# EAGLE design FlightComputer_RevA (EAGLE 9.0.1)
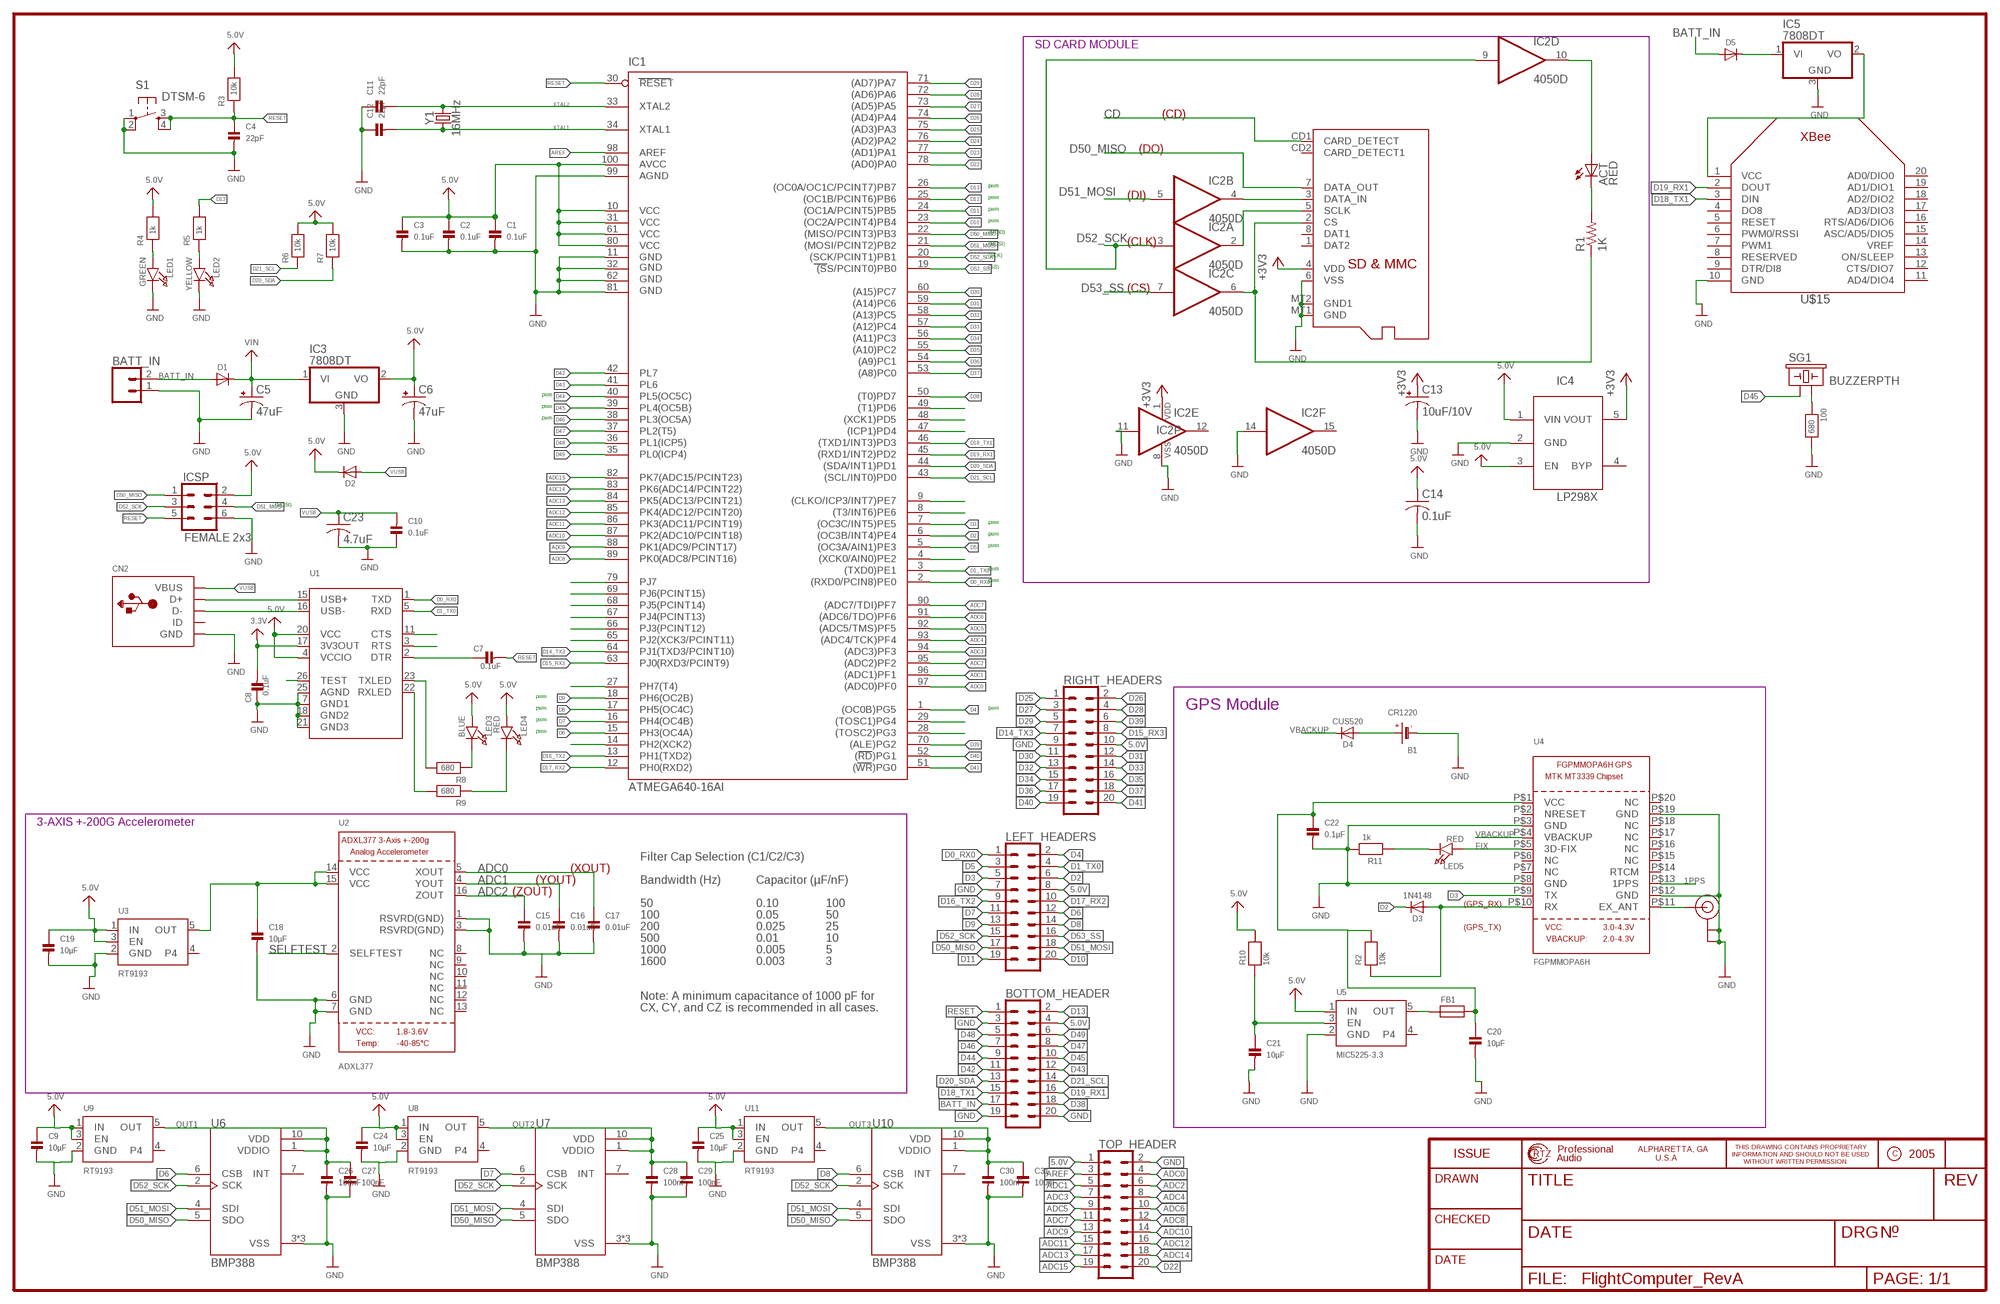
[diagram p0: schematic, sheet 1]

## Parts
100  680  RESISTOR0603  [0603]
ACT  RED  LEDCHIP-LED0805  [CHIP-LED0805]
B1  CR1220  BATTERYCR1220_SMT  [CR1220]
BATT_IN  CONN_02  [1X02]
BOTTOM_HEADER  CONN_10X2  [2X10]
C1  0.1uF  CAP_CERAMIC0603  [0603]
C2  0.1uF  CAP_CERAMIC0603  [0603]
C3  0.1uF  CAP_CERAMIC0603  [0603]
C4  22pF  CAP_CERAMIC0603  [0603]
C5  47uF  CPOL-USD  [PANASONIC_D]
C6  47uF  CPOL-USD  [PANASONIC_D]
C7  0.1uF  CAP_CERAMIC0603  [0603]
C8  0.1uF  CAP_CERAMIC0603  [0603]
C9  10µF  CAP_CERAMIC0603  [0603]
C10  0.1uF  CAP_CERAMIC0603  [0603]
C11  22pF  CAP_CERAMIC0603  [0603]
C12  22pF  CAP_CERAMIC0603  [0603]
C13  10uF/10V  CPOL-USA/3216-18R  [A/3216-18R]
C14  0.1uF  C-USC0805K  [C0805K]
C15  0.01uF  CAP_CERAMIC0603  [0603]
C16  0.01uF  CAP_CERAMIC0603  [0603]
C17  0.01uF  CAP_CERAMIC0603  [0603]
C18  10µF  CAP_CERAMIC0603  [0603]
C19  10µF  CAP_CERAMIC0603  [0603]
C20  10µF  CAP_CERAMIC0603  [0603]
C21  10µF  CAP_CERAMIC0603  [0603]
C22  0.1µF  CAP_CERAMIC0603  [0603]
C23  4.7uF  C-USC0603  [C0603]
C24  10µF  CAP_CERAMIC0603  [0603]
C25  10µF  CAP_CERAMIC0603  [0603]
C26  100nF  CAP_CERAMIC0603  [0603]
C27  100nF  CAP_CERAMIC0603  [0603]
C28  100nF  CAP_CERAMIC0603  [0603]
C29  100nF  CAP_CERAMIC0603  [0603]
C30  100nF  CAP_CERAMIC0603  [0603]
C31  100nF  CAP_CERAMIC0603  [0603]
CN2  USBMINIB  [USB-MINIB]
D1  DIODESOD-123  [SOD-123]
D2  DIODESOD-123  [SOD-123]
D3  1N4148  DIODESOD-323  [SOD-323]
D4  CUS520  DIODESOD-323  [SOD-323]
D5  DIODESOD-123  [SOD-123]
FB1  FERRITE  [0603]
IC1  ATMEGA640-16AI  [TQFP100]
IC2  4050D  [SO16]
IC3  7808DT  [TO252]
IC4  LP298XS  [SOT23-5L]
IC5  7808DT  [TO252]
ICSP  FEMALE 2x3  CONN_03X2FEMALE  [2X3]
LED1  GREEN  LED0603  [CHIPLED_0603]
LED2  YELLOW  LED0603  [CHIPLED_0603]
LED3  BLUE  LED0603  [CHIPLED_0603]
LED4  RED  LED0603  [CHIPLED_0603]
LED5  RED  LED0805  [CHIPLED_0805]
LEFT_HEADERS  CONN_10X2  [2X10]
R1  1K  R-US_R0805  [R0805]
R2  10k  RESISTOR0603  [0603]
R3  10k  RESISTOR0603  [0603]
R4  1k  RESISTOR0603  [0603]
R5  1k  RESISTOR0603  [0603]
R6  10k  RESISTOR0603  [0603]
R7  10k  RESISTOR0603  [0603]
R8  680  RESISTOR0603  [0603]
R9  680  RESISTOR0603  [0603]
R10  10k  RESISTOR0603  [0603]
R11  1k  RESISTOR0603  [0603]
RIGHT_HEADERS  CONN_10X2  [2X10]
S1  DTSM-6  [DTSM-6]
SG1  BUZZERPTH  [BUZZER-12MM]
TOP_HEADER  CONN_10X2  [2X10]
U1  FT232RLSSOP28  [SSOP28DB]
U2  ADXL377  ACCEL_ADXL377  [LFCSP16_LQ]
U3  RT9193  VREG_SOT23-5  [SOT23-5]
U4  FGPMMOPA6H  GPS_FGPMMOPA6H  [FGPMMOPA6H]
U5  MIC5225-3.3  VREG_SOT23-5  [SOT23-5]
U6  BMP388  [PQFN50P200X200X80-10N]
U7  BMP388  [PQFN50P200X200X80-10N]
U8  RT9193  VREG_SOT23-5  [SOT23-5]
U9  RT9193  VREG_SOT23-5  [SOT23-5]
U10  BMP388  [PQFN50P200X200X80-10N]
U11  RT9193  VREG_SOT23-5  [SOT23-5]
U$15  XBEE  [XBEE]
U$55  U.FL  [U.FL]
X1  MICROSD  [MICROSD]
Y1  16MHz  CRYSTAL-16MHZPTH-HC49US  [HC49US]

## Nets
1PPS: U4.P$13(1PPS)
3.3V: C8.2 U1.17(3V3OUT)
5.0V: BOTTOM_HEADER.4 C1.1 C2.1 C3.1 C6.+ C9.1 C14.1 C19.1 C24.1 C25.1 D2.C IC1.10(VCC) IC1.31(VCC1) IC1.61(VCC2) IC1.80(VCC3) IC1.100(AVCC) IC3.2(VO) IC4.1(VIN) IC4.3(EN) ICSP.2 LED3.A LED4.A LEFT_HEADERS.8 R3.2 R4.2 R6.2 R7.2 R10.2 RIGHT_HEADERS.10 TOP_HEADER.1 U1.4(VCCIO) U1.20(VCC) U3.1(IN) U3.3(EN) U5.1(IN) U8.1(IN) U8.3(EN) U9.1(IN) U9.3(EN) U11.1(IN) U11.3(EN)
+3V3: C13.+ IC2.1(P:VDD) IC4.5(VOUT) X1.4(VDD)
ADC0: C17.1 IC1.97((ADC0)PF0) TOP_HEADER.4 U2.5(XOUT)
ADC1: C16.1 IC1.96((ADC1)PF1) TOP_HEADER.5 U2.4(YOUT)
ADC2: C15.1 IC1.95((ADC2)PF2) TOP_HEADER.6 U2.16(ZOUT)
ADC3: IC1.94((ADC3)PF3) TOP_HEADER.7
ADC4: IC1.93((ADC4/TCK)PF4) TOP_HEADER.8
ADC5: IC1.92((ADC5/TMS)PF5) TOP_HEADER.9
ADC6: IC1.91((ADC6/TDO)PF6) TOP_HEADER.10
ADC7: IC1.90((ADC7/TDI)PF7) TOP_HEADER.11
ADC8: IC1.89(PK0(ADC8/PCINT16)) TOP_HEADER.12
ADC9: IC1.88(PK1(ADC9/PCINT17)) TOP_HEADER.13
ADC10: IC1.87(PK2(ADC10/PCINT18)) TOP_HEADER.14
ADC11: IC1.86(PK3(ADC11/PCINT19)) TOP_HEADER.15
ADC12: IC1.85(PK4(ADC12/PCINT20)) TOP_HEADER.16
ADC13: IC1.84(PK5(ADC13/PCINT21)) TOP_HEADER.17
ADC14: IC1.83(PK6(ADC14/PCINT22)) TOP_HEADER.18
ADC15: IC1.82(PK7(ADC15/PCINT23)) TOP_HEADER.19
AREF: IC1.98(AREF) TOP_HEADER.3
BATT_IN: BATT_IN.2 BOTTOM_HEADER.17 D1.A D5.A
CD: X1.CD1(CARD_DETECT)
D0_RX0: IC1.2((RXD0/PCIN8)PE0) LEFT_HEADERS.1 U1.1(TXD)
D1_TX0: IC1.3((TXD0)PE1) LEFT_HEADERS.4 U1.5(RXD)
D2: D3.C IC1.6((OC3B/INT4)PE4) LEFT_HEADERS.6
D3: IC1.7((OC3C/INT5)PE5) LEFT_HEADERS.5 U4.P$9(TX)
D4: IC1.1((OC0B)PG5) LEFT_HEADERS.2
D5: IC1.5((OC3A/AIN1)PE3) LEFT_HEADERS.3
D6: IC1.15(PH3(OC4A)) LEFT_HEADERS.12 U6.6(CSB)
D7: IC1.16(PH4(OC4B)) LEFT_HEADERS.11 U7.6(CSB)
D8: IC1.17(PH5(OC4C)) LEFT_HEADERS.14 U10.6(CSB)
D9: IC1.18(PH6(OC2B)) LEFT_HEADERS.13
D10: IC1.23((OC2A/PCINT4)PB4) LEFT_HEADERS.20
D11: IC1.24((OC1A/PCINT5)PB5) LEFT_HEADERS.19
D12: IC1.25((OC1B/PCINT6)PB6)
D13: BOTTOM_HEADER.2 IC1.26((OC0A/OC1C/PCINT7)PB7) R5.2
D14_TX3: IC1.64(PJ1(TXD3/PCINT10)) RIGHT_HEADERS.7
D15_RX3: IC1.63(PJ0(RXD3/PCINT9)) RIGHT_HEADERS.8
D16_TX2: IC1.13(PH1(TXD2)) LEFT_HEADERS.9
D17_RX2: IC1.12(PH0(RXD2)) LEFT_HEADERS.10
D18_TX1: BOTTOM_HEADER.15 IC1.46((TXD1/INT3)PD3) U$15.3(DIN)
D19_RX1: BOTTOM_HEADER.16 IC1.45((RXD1/INT2)PD2) U$15.2(DOUT)
D20_SDA: BOTTOM_HEADER.13 IC1.44((SDA/INT1)PD1) R7.1
D21_SCL: BOTTOM_HEADER.14 IC1.43((SCL/INT0)PD0) R6.1
D22: IC1.78((AD0)PA0) TOP_HEADER.20
D23: IC1.77((AD1)PA1)
D24: IC1.76((AD2)PA2)
D25: IC1.75((AD3)PA3) RIGHT_HEADERS.1
D26: IC1.74((AD4)PA4) RIGHT_HEADERS.2
D27: IC1.73((AD5)PA5) RIGHT_HEADERS.3
D28: IC1.72((AD6)PA6) RIGHT_HEADERS.4
D29: IC1.71((AD7)PA7) RIGHT_HEADERS.5
D30: IC1.60((A15)PC7) RIGHT_HEADERS.11
D31: IC1.59((A14)PC6) RIGHT_HEADERS.12
D32: IC1.58((A13)PC5) RIGHT_HEADERS.13
D33: IC1.57((A12)PC4) RIGHT_HEADERS.14
D34: IC1.56((A11)PC3) RIGHT_HEADERS.15
D35: IC1.55((A10)PC2) RIGHT_HEADERS.16
D36: IC1.54((A9)PC1) RIGHT_HEADERS.17
D37: IC1.53((A8)PC0) RIGHT_HEADERS.18
D38: BOTTOM_HEADER.18 IC1.50((T0)PD7)
D39: IC1.70((ALE)PG2) RIGHT_HEADERS.6
D40: IC1.52((RD)PG1) RIGHT_HEADERS.19
D41: IC1.51((WR)PG0) RIGHT_HEADERS.20
D42: BOTTOM_HEADER.11 IC1.42(PL7)
D43: BOTTOM_HEADER.12 IC1.41(PL6)
D44: BOTTOM_HEADER.9 IC1.40(PL5(OC5C))
D45: BOTTOM_HEADER.10 IC1.39(PL4(OC5B)) SG1.+
D46: BOTTOM_HEADER.7 IC1.38(PL3(OC5A))
D47: BOTTOM_HEADER.8 IC1.37(PL2(T5))
D48: BOTTOM_HEADER.5 IC1.36(PL1(ICP5))
D49: BOTTOM_HEADER.6 IC1.35(PL0(ICP4))
D50_MISO: IC1.22((MISO/PCINT3)PB3) ICSP.1 LEFT_HEADERS.17 U6.5(SDO) U7.5(SDO) U10.5(SDO) X1.7(DATA_OUT)
D51_MOSI: IC1.21((MOSI/PCINT2)PB2) IC2.5(B:I) ICSP.4 LEFT_HEADERS.18 U6.4(SDI) U7.4(SDI) U10.4(SDI)
D52_SCK: IC1.20((SCK/PCINT1)PB1) IC2.3(A:I) IC2.9(D:I) ICSP.3 LEFT_HEADERS.15 U6.2(SCK) U7.2(SCK) U10.2(SCK)
D53_SS: IC1.19((SS/PCINT0)PB0) IC2.7(C:I) LEFT_HEADERS.16
FIX: LED5.A U4.P$5(3D-FIX)
GND: 100.2 B1.- BATT_IN.1 BOTTOM_HEADER.3 BOTTOM_HEADER.19 BOTTOM_HEADER.20 C1.2 C2.2 C3.2 C4.2 C5.- C6.- C8.1 C9.2 C10.1 C11.1 C12.1 C13.- C14.2 C15.2 C16.2 C17.2 C18.2 C19.2 C20.2 C21.2 C22.2 C23.2 C24.2 C25.2 C26.2 C27.2 C28.2 C29.2 C30.2 C31.2 CN2.GND IC1.11(GND) IC1.32(GND1) IC1.62(GND2) IC1.81(GND3) IC1.99(AGND) IC2.8(P:VSS) IC2.11(E:I) IC2.14(F:I) IC3.3(GND) IC4.2(GND) IC5.3(GND) ICSP.6 LED1.C LED2.C LEFT_HEADERS.7 R11.2 RIGHT_HEADERS.9 S1.1 S1.2 TOP_HEADER.2 U1.7(GND1) U1.18(GND2) U1.21(GND3) U1.25(AGND) U2.1(RSVRD(GND)) U2.3(RSVRD(GND)) U2.6(GND) U2.7(GND) U3.2(GND) U4.P$3(GND) U4.P$8(GND) U4.P$12(GND) U4.P$19(GND) U5.2(GND) U6.3(VSS) U6.8(VSS) U6.9(VSS) U7.3(VSS) U7.8(VSS) U7.9(VSS) U8.2(GND) U9.2(GND) U10.3(VSS) U10.8(VSS) U10.9(VSS) U11.2(GND) U$15.10(GND) U$55.P$1(GND) U$55.P$2(GND) X1.6(VSS) X1.MT1(GND) X1.MT2(GND1)
N$1: IC1.65(PJ2(XCK3/PCINT11))
N$2: IC1.66(PJ3(PCINT12))
N$3: ACT.A IC2.10(D:O)
N$4: IC1.67(PJ4(PCINT13))
N$5: IC1.68(PJ5(PCINT14))
N$6: IC1.69(PJ6(PCINT15))
N$7: IC1.79(PJ7)
N$8: IC1.27(PH7(T4))
N$9: IC1.9((CLKO/ICP3/INT7)PE7)
N$10: IC1.49((T1)PD6)
N$11: IC1.48((XCK1)PD5)
N$12: IC1.47((ICP1)PD4)
N$13: IC1.14(PH2(XCK2))
N$14: IC1.8((T3/INT6)PE6)
N$15: D5.C IC5.1(VI)
N$16: CN2.D+ U1.15(USB+)
N$17: CN2.D- U1.16(USB-)
N$18: IC1.4((XCK0/AIN0)PE2)
N$19: LED1.A R4.1
N$20: LED2.A R5.1
N$21: LED3.C R8.1
N$22: R9.2 U1.22(RXLED)
N$23: R8.2 U1.23(TXLED)
N$24: LED4.C R9.1
N$25: IC1.29((TOSC1)PG4)
N$26: IC1.28((TOSC2)PG3)
N$27: IC2.2(A:O) X1.5(SCLK)
N$28: U1.26(TEST)
N$29: U1.11(CTS)
N$30: U1.3(RTS)
N$31: C7.1 U1.2(DTR)
N$32: IC2.6(C:O) R1.1 X1.2(CS)
N$33: ACT.C R1.2
N$34: IC2.4(B:O) X1.3(DATA_IN)
N$35: U4.P$11(EX_ANT) U$55.P$3(SIGNAL)
N$36: C18.1 U2.14(VCC) U2.15(VCC) U3.5(OUT)
N$37: C21.1 R10.1 U5.3(EN)
N$38: D3.A R2.1 U4.P$10(RX)
N$39: B1.+$1(+) B1.+$2(+) D4.A
N$40: C20.1 C22.1 FB1.2 R2.2 U4.P$1(VCC)
N$42: 100.1 SG1.-
N$43: LED5.C R11.1
OUT: FB1.1 U5.5(OUT)
OUT1: C26.1 C27.1 U6.1(VDDIO) U6.10(VDD) U9.5(OUT)
OUT2: C28.1 C29.1 U7.1(VDDIO) U7.10(VDD) U8.5(OUT)
OUT3: C30.1 C31.1 U10.1(VDDIO) U10.10(VDD) U11.5(OUT)
RESET: BOTTOM_HEADER.1 C4.1 C7.2 IC1.30(RESET) ICSP.5 R3.1 S1.3 S1.4
SELFTEST: U2.2(SELFTEST)
VBACKUP: D4.C U4.P$4(VBACKUP)
VCC: IC5.2(VO) U$15.1(VCC)
VIN: C5.+ D1.C IC3.1(VI)
VUSB: C10.2 C23.1 CN2.VBUS D2.A
XTAL1: C12.2 IC1.34(XTAL1) Y1.1
XTAL2: C11.2 IC1.33(XTAL2) Y1.2
Unconnected: CN2.ID IC2.12(E:O) IC2.15(F:O) IC4.4(BYP) U2.8(NC) U2.9(NC) U2.10(NC) U2.11(NC) U2.12(NC) U2.13(NC) U3.4 U4.P$2(NRESET) U4.P$6(NC) U4.P$7(NC) U4.P$14(RTCM) U4.P$15(NC) U4.P$16(NC) U4.P$17(NC) U4.P$18(NC) U4.P$20(NC) U5.4 U6.7(INT) U7.7(INT) U8.4 U9.4 U10.7(INT) U11.4 U$15.4(DO8) U$15.5(RESET) U$15.6(PWM0/RSSI) U$15.7(PWM1) U$15.8(RESERVED) U$15.9(DTR/DI8) U$15.11(AD4/DIO4) U$15.12(CTS/DIO7) U$15.13(ON/SLEEP) U$15.14(VREF) U$15.15(ASC/AD5/DIO5) U$15.16(RTS/AD6/DIO6) U$15.17(AD3/DIO3) U$15.18(AD2/DIO2) U$15.19(AD1/DIO1) U$15.20(AD0/DIO0) X1.1(DAT2) X1.8(DAT1) X1.CD2(CARD_DETECT1)

## Notes on the sheet
- SD CARD MODULE
- (CD)
- (DO)
- pwm
- pwm | (DI)
- pwm
- pwm
- (MISO)
- (MOSI) | (CLK)
- (SCK)
- (SS)
- (CS)
- pwm
- pwm
- pwm
- (MOSI)
- pwm
- pwm
- pwm
- pwm
- pwm
- pwm
- pwm | pwm | GPS Module
- pwm
- pwm
- 3-AXIS +-200G Accelerometer
- Filter Cap Selection (C1/C2/C3)
- (XOUT)
- (YOUT) | Bandwidth (Hz) | Capacitor (µF/nF)
- (ZOUT)
- 50 | 0.10 | 100 | (GPS_RX)
- 100 | 0.05 | 50
- 200 | 0.025 | 25 | (GPS_TX)
- 500 | 0.01 | 10
- 1000 | 0.005 | 5
- 1600 | 0.003 | 3
- Note: A minimum capacitance of 1000 pF for
- CX, CY, and CZ is recommended in all cases.

## Library data of the parts
100 R2-R11 = microbuilder:RESISTOR: Resistors 0402 - 0402 Surface Mount Package 22 Ohm 1% 1/16W [Digikey: 311-22.0LRTR-ND] 33 Ohm 5% 1/16W 1.0K 5% 1/16W 1.5K 5% 1/16W 2.0K 1% 1/16W 10.0K 1% 1/16W [Digikey: 311-10.0KLRTR-ND] 10.0K 5% 1/16W [Digikey: RMCF0402JT10K0TR-ND] 12.1K 1% 1/16W [Digikey: 311-22.0LRTR-ND] 100.0K 5% 1/16W 0603 - 0603 Surface Mount Package 0 Ohm 1/10 Watt 1% Resistor 15 Ohm 1/10 Watt 1% Resistor 33 Ohm 1/10 Watt 1% Resistor 49.9 Ohm 1/10 Watt 1% Resistor 100 Ohm 1/10 Watt 1% Resistor 150 Ohm 1/10 Watt 1% Resistor 240 Ohm 1/10 Watt 1% Resistor 390 Ohm 1/10 Watt 1% Resistor 560 Ohm 1/10 Watt 1% Resistor 680 Ohm 1/10 Watt 1% Resistor 750 Ohm 1/10 Watt 1% Resistor 1.0K Ohm 1/10 Watt 1% Resistor 1.5K Ohm 1/10 Watt 1% Resistor 2.0K Ohm 1/10 Watt 1% Resistor 2.2K Ohm 1/10 Watt 1% Resistor 3.3K Ohm 1/10 Watt 1% Resistor 4.7K Ohm 1/10 Watt 1% Resistor 10.0K Ohm 1/10 Watt 1% Resistor 12.0K Ohm 1/10 Watt 1% Resistor 12.1K Ohm 1/10 Watt 1% Resistor 20.0K Ohm 1/10 Watt 1% Resistor 33.0K Ohm 1/10 Watt 1% Resistor 100.0K Ohm 1/10 Watt 1% Resistor 0805 - 0805 Surface Mount Package 0 Ohm 1/8 Watt 1% Resistor 33 Ohm 1/8 Watt 1% Resistor 100 Ohm 1/8 Watt 1% Resistor 150 Ohm 1/8 Watt 1% Resistor 200 Ohm 1/8 Watt 1% Resistor 240 Ohm 1/8 Watt 1% Resistor 330 Ohm 1/8 Watt 1% Resistor 390 Ohm 1/8 Watt 1% Resistor 470 Ohm 1/8 Watt 1% Resistor 1.0K Ohm 1/8 Watt 1% Resistor 1.5K Ohm 1/8 Watt 1% Resistor 2.0K Ohm 1/8 Watt 1% Resistor 4.7K Ohm 1/8 Watt 1% Resistor 5.1K Ohm 1/8 Watt 1% Resistor 5.6K Ohm 1/8 Watt 1% Resistor 10.0K Ohm 1/8 Watt 1% Resistor 22.0K Ohm 1/8 Watt 1% Resistor 33.0K Ohm 1/8 Watt 1% Resistor 100K Ohm 1/8 Watt 1% Resistor 1206 - 1206 Surface Mount Package 2012 - 2010 Surface Mount Package 0.11 Ohm 1/2 Watt 1% Resistor - Digikey: RHM.11UCT-ND
ACT = adafruit:LED: LED
B1 = microbuilder:BATTERY: CR1220 SMT - Digikey: 3001K-ND CD2032 BAT-HLD-001 - Digikey: BAT-HLD-001-ND
BATT_IN = SparkFun-Connectors:CONN_02: Multi connection point. Often used as Generic Header-pin footprint for 0.1 inch spaced/style header connections On any of the 0.1 inch spaced packages, you can populate with these: Break Away Headers - Straight <https://www.sparkfun.com/products/116> (PRT-00116) Break Away Male Headers - Right Angle <https://www.sparkfun.com/products/553> (PRT-00553) Female Headers <https://www.sparkfun.com/products/115> (PRT-00115) Break Away Headers - Machine Pin <https://www.sparkfun.com/products/117> (PRT-00117) Break Away Female Headers - Swiss Machine Pin <https://www.sparkfun.com/products/743> (PRT-00743) For SCREWTERMINALS and SPRING TERMINALS visit here: Screw Terimnals on SparkFun.com <https://www.sparkfun.com/search/results?term=Screw+Terminals> (5mm/3.5mm/2.54mm spacing) This device is also useful as a general connection point to wire up your design to another part of your project. Our various solder wires solder well into these plated through hole pads. Hook-Up Wire - Assortment (Stranded, 22 AWG) <https://www.sparkfun.com/products/11375> (PRT-11375) Hook-Up Wire - Assortment (Solid Core, 22 AWG) <https://www.sparkfun.com/products/11367> (PRT-11367) View the entire wire category on our website here <https://www.sparkfun.com/categories/141> Special notes: Molex polarized connector foot print use with: PRT-08233 with associated crimp pins and housings. 2.54_SCREWTERM for use with PRT-10571. 3.5mm Screw Terminal footprints for PRT-08084 5mm Screw Terminal footprints for use with PRT-08432
BOTTOM_HEADER LEFT_HEADERS RIGHT_HEADERS TOP_HEADER = SparkFun-Connectors:CONN_10X2: Multi connection point. Often used as Generic Header-pin footprint for 0.1 inch spaced/style header connections On any of the 0.1 inch spaced packages, you can populate with these: Break Away Headers - Straight <https://www.sparkfun.com/products/116> (PRT-00116) Break Away Male Headers - Right Angle <https://www.sparkfun.com/products/553> (PRT-00553) Female Headers <https://www.sparkfun.com/products/115> (PRT-00115) Break Away Headers - Machine Pin <https://www.sparkfun.com/products/117> (PRT-00117) Break Away Female Headers - Swiss Machine Pin <https://www.sparkfun.com/products/743> (PRT-00743) Special note about the "SPECIAL" package: This was SPECIALLY designed to be used with our Graphic LCD Backpack. Be sure you want to use this! It is not only staggered on each line of header holes, but IT IS ALSO offset of the center point of the top and bottom lines by 5 mil. This causes the headers to lock into place on the "standard" footprint on the LCD screen. The extra squares on the tdocu layer are there simply to reference other pins (if you were to actually populate a longer header than ten long - this is what we do with the backpacks).
C1-C4 C7-C12 C15-C22 C24-C31 = microbuilder:CAP_CERAMIC: Ceramic Capacitors 0402 - 0402 Surface Mount Capacitors 16pF 50V 5% [Digikey: 445-4899-2-ND] 18pF 50V 5% [Digikey: 490-1281-2-ND] 22pF 50V 5% [Digikey: 490-1283-2-ND] 68pF 50V 5% [Digikey: 490-1289-2-ND] 0.1uF 10V 10% [Digikey: 490-1318-2-ND] 1.0uF 6.3V 10% [Digikey: 490-1320-2-ND] 0603 - 0603 Surface Mount Capacitors 16 pF 50V 5% [Digikey: 445-5051-2-ND] 22 pF 50V [Digikey: PCC220ACVTR-ND] 33 pF 50V 5% [Digikey: 490-1415-1-ND] 56pF 50V 5% [Digikey: 490-1421-1-ND] 220pF 50V 5% [Digikey: 445-1285-1-ND] 680 pF 50V 2200 pF 50V 5% C0G [Digikey: 445-1297-1-ND] 5600 pF 100V 5% X7R [Digikey: 478-3711-1-ND] 0.1 µF 25V 10% [Digikey: PCC2277TR-ND] 0.22 µF 16V 10% X7R [Digikey: 445-1318-1-ND] 1.0 µF 25V 10% [Digikey: 445-5146-2-ND] 0603 - RF Specific 3pF 250V +/-0.1pF RF [Digikey: 712-1347-1-ND] 18 pF 250V 5% [Digikey: 478-3505-1-ND or 712-1322-1-ND] 56 pF 250V 5% C0G RF [Digikey: 490-4867-1-ND] 68 pF 250V RF [Digikey: 490-4868-1-ND] 0805 - 0805 Surface Mount Capacitors 220 pF 250V 2% RF Ceramic Capacitor [Digikey: 712-1398-1-ND] 1000 pF 50V 2% NP0 Ceramic Capacitor [Digikey: 478-3760-1-ND] 0.1 µF 25V 10% Ceramic Capacitor [Digikey: PCC1828TR-ND] 1.0 µF 16V 10% Ceramic Capacitor[Digikey: 490-1691-2-ND] 10.0 µF 10V 10% Ceramic Capacitor[Digikey: 709-1228-1-ND] 10.0 uF 16V 10% Ceramic Capacitor [Digikey: 478-5165-2-ND] 47 uF 6.3V 20% Ceramic Capacitor [Digikey: 587-1779-1-ND or 399-5506-1-ND] 1206 - 1206 Surface Mount Capacitors 47uF 10V 20% Ceramic Capacitor [Digikey: 490-5528-1-ND or 399-5508-1-ND or 445-6010-1-ND]
C5 C6 = rcl:CPOL-US: POLARIZED CAPACITOR, American symbol; SPICEPREFIX: C
C13 = adafruit:CPOL-US: POLARIZED CAPACITOR, American symbol
C14 C23 = adafruit:C-US: CAPACITOR, American symbol
CN2 = adafruit:USB: USB Connectors USBMINIB - Surface Mount Female Mini-B USB Connector 4UConnector: 06564 By microbuilder.eu Thru-hole RA Female Mini-B USB Connector 4UConnector: 18732 By ladyada.net
D1-D5 = microbuilder:DIODE: Diode SMA Model Volts Amps Type Vf Ir Digikey # Notes SSA34-E3 40V 3A Schottky 480mV @ 3A 200uA @ 40V SSA34-E3/61TGITR-ND CDBA120-G 20V 1A Schottky 500mV @ 1A 500uA @ 20V 641-1014-6-ND REEL MBRA210 10V 2A Schottky 350mV @ 2A 700uA @ 10V MBRA210LT3 SOD-123 Model Volts Amps Type Vf Ir Order # Notes BAT54T1G 30V 200mA Schottky 800mV @ 200mA 2uA @ 25V BAT54T1GOSTR-ND B0530W 30V 500mA Schottky 430mV @ 500mA 130uA @ 30V B0530W-FDICT-ND REEL MBR120 20V 1A Schottky 340mV @ 1A MBR120VLSFT1GOSCT-ND SOD-323 Model Volts Amps Type Vf Ir Order # Notes PMEG2005EJ 20V 500mA Schottky 355mV @ 500mA 568-4110-1-ND ZLLS410 10V 570mA Schottky 380mV @ 570mA ZLLS410CT-ND 1N4148WS 75V 150mA Silicon/Simple 1V 1N4148WSFSCT-ND REEL SOD-523 Model Volts Amps Type Vf Ir Order # Notes BAT54XV2 30V 200mA Schottky 0.8V @ 100mA BAT54XV2CT-ND TB751S 30V 30mA Schottky RB751S-40TE61CT-ND SOT23-R/W (R = Solder Paste/Reflow Ovens, W = Hand-Soldering) Model Volts Amps Type Vf Ir Order # Notes BAT54FILM 40V 300mA Schottky 497-7162-1-ND POWERDI-5 Model Volts Amps Type Vf Ir Order # Notes PDS560 60V 5A Schottky 670mV @ 5A 150uA @ 60V PDS560DICT-ND
FB1 = microbuilder:FERRITE: Ferrite Bead 0603 MMZ1608B121C - 120 Ohm, 600mA Ferrite Chip - Digikey: 445-2164-1-ND BK1608HW121-T - 120 Ohm, 600mA Ferrite Chip - Digikey: 587-1876-2-ND
IC1 = atmel-2005:ATMEGA*: MICROCONTROLLER 64/128/256 Kbytes FLASH 4 Kbytes EEPROM 8 Kbytes SRAM 86 General Purpose I/O pins 12-channels16-bit PWM 4 x Serial USARTs 16-channels 10-bit A/D
IC2 = 40xx:4050: Hex non-inverting BUFFER
IC3 IC5 = adafruit:78*: Positive VOLTAGE REGULATOR Added bigger pads to the TO-92 package
IC4 = adafruit:LP298X
ICSP = SparkFun-Connectors:CONN_03X2: Multi connection point. Often used as Generic Header-pin footprint for 0.1 inch spaced/style header connections You can populate with any combo of single row headers, but if you'd like an exact match, check these: Header - 2x3 (Male, 0.1") <https://www.sparkfun.com/products/12807> (PRT-12807) Header - 2x3 (Female, 0.1") <https://www.sparkfun.com/products/13010> (PRT-13010) 2x3 Pin Shrouded Header <https://www.sparkfun.com/products/10877> (PRT-10877) On any of the 0.1 inch spaced packages, you can populate with these: Break Away Headers - Straight <https://www.sparkfun.com/products/116> (PRT-00116) Break Away Male Headers - Right Angle <https://www.sparkfun.com/products/553> (PRT-00553) Female Headers <https://www.sparkfun.com/products/115> (PRT-00115) Break Away Headers - Machine Pin <https://www.sparkfun.com/products/117> (PRT-00117) Break Away Female Headers - Swiss Machine Pin <https://www.sparkfun.com/products/743> (PRT-00743) Special note: the shrouded connector mates well with our 3x2 ribbon cables: Ribbon Crimp Connector - 6-pin (2x3, Female) <https://www.sparkfun.com/products/10651> (PRT-10651) Ribbon Cable - 6 wire (15ft) <https://www.sparkfun.com/products/10646> (PRT-10646); PROD_ID: CONN-11566
LED1-LED5 = microbuilder:LED: LED
R1 = adafruit:R-US_: RESISTOR, American symbol
S1 = switch-tact:DTSM-6
SG1 = SparkFun:BUZZER: Buzzer 12mm Spark Fun Electronics SKU : Comp-Buzzer
U1 = microbuilder:FT232RL: FTDI FT232RL USB TO RS232 Converter Digikey: 768-1007-1-ND
U2 = microbuilder:ACCEL_ADXL377: ADXL377 +/-200g 3-Axis Analog Accelerometer VCC: 1.8-3.6V
U3 U5 U8 U9 U11 = microbuilder:VREG_SOT23-5: SOT23-5 Fixed Voltage Regulators Part Current Out V Out V In V Dropout θJA (°C/W) TJ (°C) Digikey Part No. ADP121 150mA 3.3V 3.4-5.5V 0.09V @ 150mA -- -- ADP121-AUJZ33R7CT-ND ADP121 150mA 3.0V 3.1-5.5V 0.09V @ 150mA -- -- ADP121-AUJZ30R7CT-ND ADP122 300mA 3.3V 3.4-5.5V 0.085V @ 300mA -- -- ADP122AUJZ-3.3-R7CT-ND ADP1712 300mA 3.3V 3.5-5.5V 0.17V @ 300mA -- -- ADP1712AUJZ-3.3-R7TR-ND AP7311 (Low Cost) 150mA 3.3V 3.5-6V 0.15V @ 150mA -- -- AP7311-33WG-7DICT-ND LD39015M18R 150mA 1.8V 1.9V-5.5V 0.08V @ 100mA -- -- 497-6977-1-ND LP2985A-33DBVR 150mA 3.3V 3.3-16V 0.28V @ 150mA 206 150 296-18479-1-ND MCP1824T-3302E/OT 300mA 3.3V 3.5V-6V 0.2V @ 300mA -- -- MCP1824T-3302E/OTCT-ND MIC5205-2.5YM5 TR 150mA 2.5V 2.7-16V 0.165V @ 150mA -- -- 576-1257-2-ND MIC5205-3.0YM5 TR 150mA 3.0V 3.2V-16V 0.165V @ 150mA -- -- 576-1258-2-ND MIC5205-3.3YM5 TR 150mA 3.3V 3.5V-16V 0.165V @ 150mA -- -- 576-1259-2-ND TPS780330220 150mA 3.3V+2.2V 3.6-5.5V 250mV Max -- -- 296-23332-1-ND TDA3663/N1,135 100mA 3.3V 3.5-45V 0.18V @ 50mA -- -- 568-5343-1-ND Max operating temp can be calculated using θJA, TJ (max junction temperature), and power in watts. Set the "Maximum Ambient Temperature" until it reaches TJ ("Max Junction Temperature"), which is the absolute limit for safe use of the regulator: Heat Sink Temperature Calculator <http://www.daycounter.com/Calculators/Heat-Sink-Temperature-Calculator.phtml> For example, With 12V source into a 3.3V LP2985 and a 30mA load, we are dissipating (12V-3.3V) * 0.03A = 0.261W. With a θJA of 206 °C/W, a TJ of 150°C, and 261mW we can safely use the chip without a heat sink up to 75°C (=147.1°C Junction Temperature).
U4 = microbuilder:GPS_FGPMMOPA6H: GPS Module - MTK MT3339 Chipset, -165dBm sensitivity, 22 channels, 10Hz, auto-select external antenna options
U6 U7 U10 = BMP388:BMP388: P-Sensor SPI I2C 1, 25 Bar SMD; AVAILABILITY: Unavailable; DESCRIPTION: P-Sensor SPI I2C 1, 25 Bar SMD; MF: Bosch Sensortec; MP: BMP388; PACKAGE: WFLGA-10 Bosch Tools; PRICE: None
U$15 = adafruit:XBEE
U$55 = microbuilder:U.FL: U.FL Antenna Connector
X1 = adafruit:MICROSD: Micro-SD / Transflash card holder with SPI pinout For the 3M # 2908-05WB-MG and/or 4UCON #19656 push-push type
Y1 = SparkFun-Clocks:CRYSTAL-16MHZ: 16MHz Crystal Digikey Example <http://www.digikey.com/product-search/en?keywords=535-9122-1-ND> Frequency: 16MHz Frequency Stability: ±50ppm Frequency Tolerance: ±20ppm Load Capacitance: 18pF SparkFun Products: Pro Micro -5V/16MHz <https://www.sparkfun.com/products/12640> SparkFun Serial Enabled LCD Kit <https://www.sparkfun.com/products/10097>; PROD_ID: XTAL-08181; SF_ID: COM-00536

## Net classes
0 default: width 0.152 mm

## Board
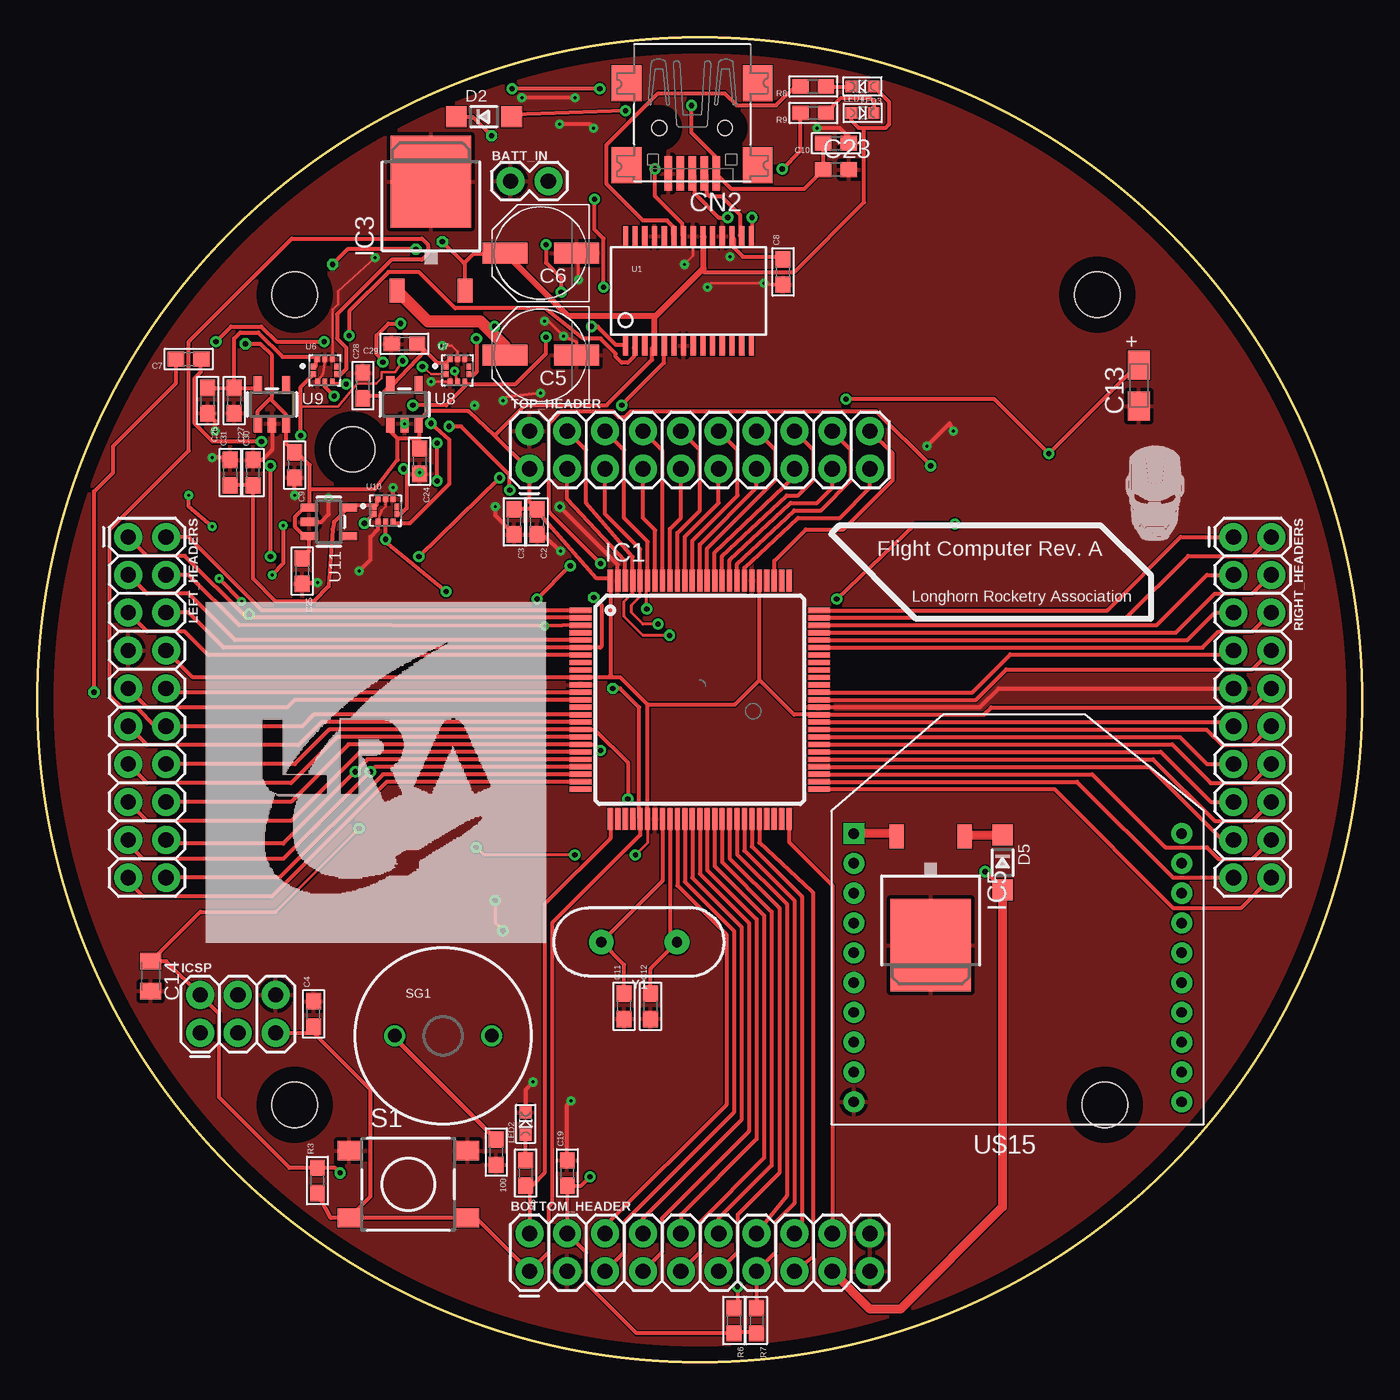
[diagram p1: board, top side]
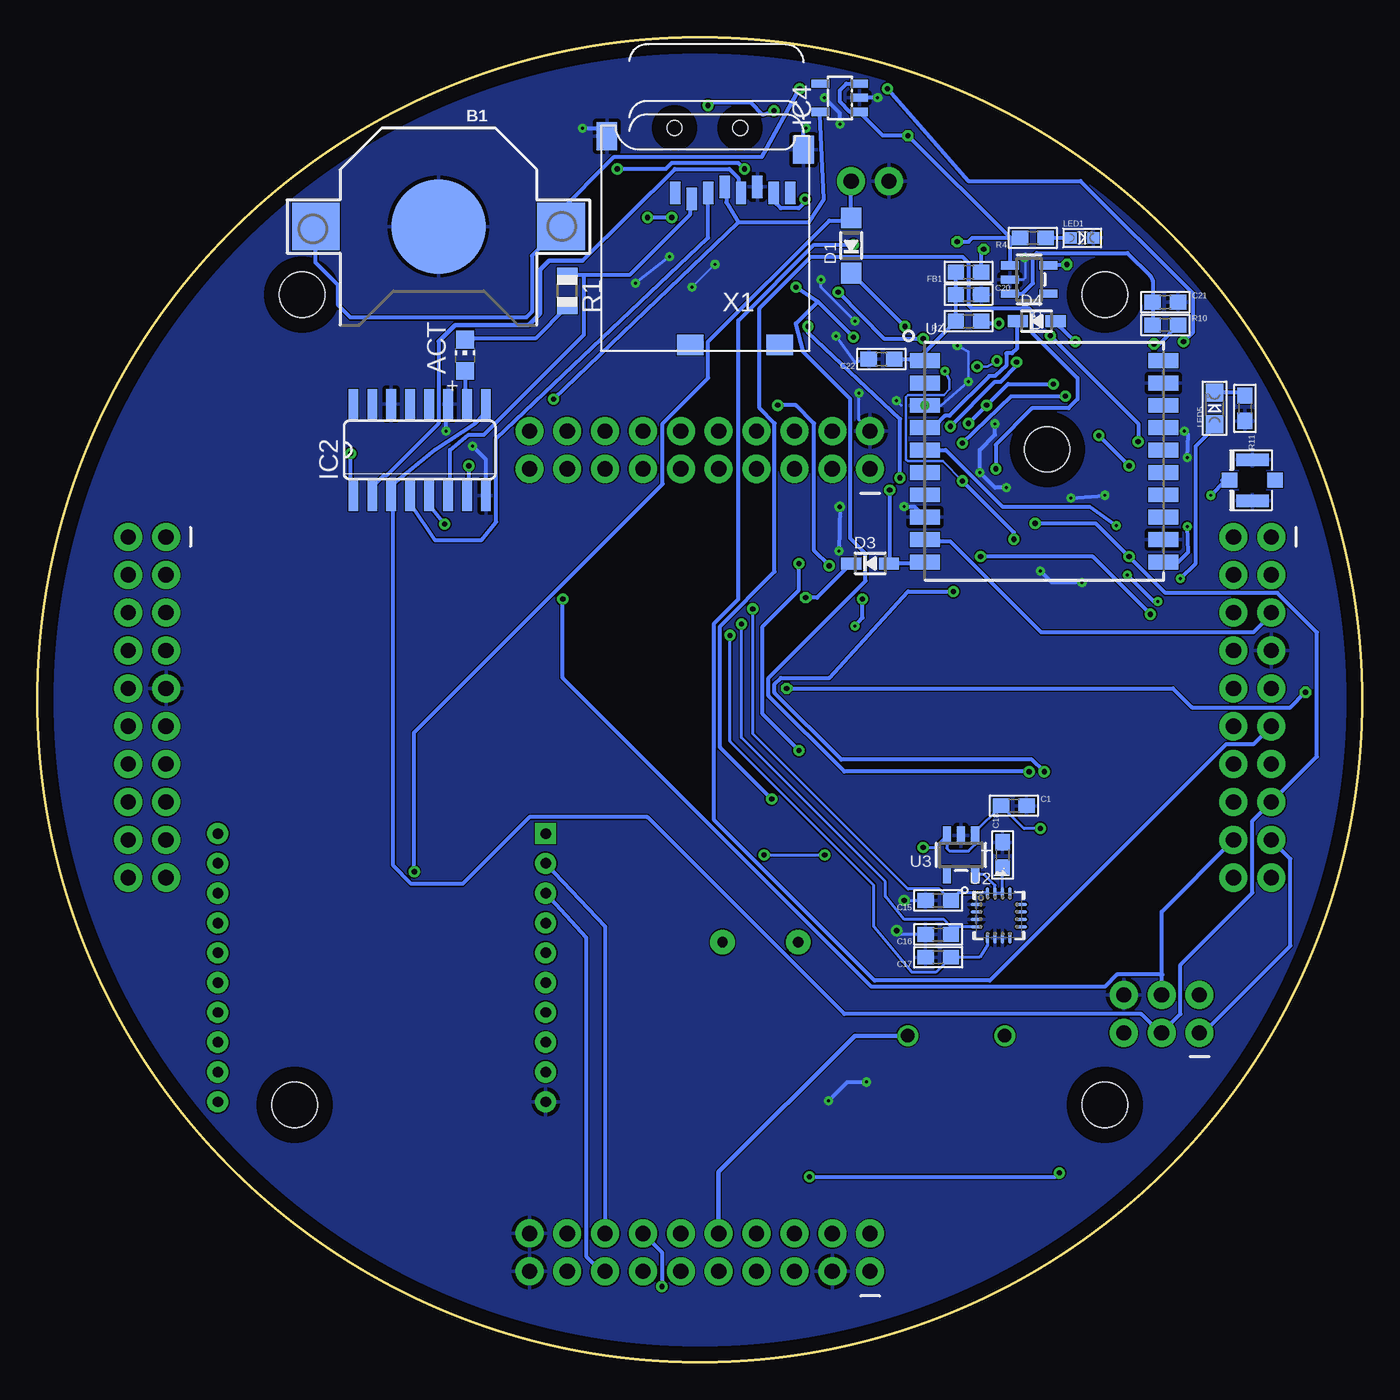
[diagram p2: board, bottom side, seen from below]

Size 88.9 x 88.9 mm. Coordinates in mm from the lower left corner, seen from the top.
Outline: circle at 44.45,44.45 radius 44.45
Copper layers (1*16): Top 0.035mm / dielectric 1.5mm / Bottom 0.035mm
Design rules "default *": minimum track width 6mil, minimum drill 0.35mm, track to track 3.5mil, track to pad 3.5mil, pad to pad 3.5mil, via to via 3.5mil, smd to smd 3.5mil, copper to edge 40mil, drill to drill 6mil, minimum pad ring 10mil, minimum via ring 8mil, stop-mask expansion 4mil, vias tented up to drill 0mil, thermal gap 10mil
Holes 3.05 mm at 17.27,71.63 71.12,71.63 71.63,17.27 17.27,17.27

### Footprints (pad centres in the part's own frame; a part is rotated, then mirrored left to right if it is on the bottom)
0603 = smd 1.1 x 1: 1 -0.85,0; 2 0.85,0
CHIP-LED0805 = smd 1.2 x 1.2: A 0,-1.05; C 0,1.05
CR1220 = smd 3.2 x 3.2: +$1 -8.225,0; +$2 8.225,0 | smd 6.35 x 6.35: - 0,0
1X02 = drill 1.016 pad 1.88: 1 0,0; 2 2.54,0
2X10 = drill 1.016 pad 1.88: 1 0,0; 2 0,2.54; 3 2.54,0; 4 2.54,2.54; 5 5.08,0; 6 5.08,2.54; 7 7.62,0; 8 7.62,2.54; 9 10.16,0; 10 10.16,2.54; 11 12.7,0; 12 12.7,2.54; 13 15.24,0; 14 15.24,2.54; 15 17.78,0; 16 17.78,2.54; 17 20.32,0; 18 20.32,2.54; 19 22.86,0; 20 22.86,2.54
PANASONIC_D = smd 3 x 1.4: + 2.4,0; - -2.4,0
A/3216-18R = smd 1.95 x 1.5: + 1.375,0; - -1.375,0
C0805K = smd 1.1 x 1.4: 1 -1,0; 2 1,0
C0603 = smd 1.1 x 1: 1 -0.85,0; 2 0.85,0
USB-MINIB = smd 0.5 x 2.308: D+ 0,4.064; D- -0.8,4.064; GND 1.6,4.064; ID 0.8,4.064; VBUS -1.6,4.064 | smd 2 x 2.4: GND1 -4.4,-2; GND2 -4.4,3.5; GND3 4.4,3.5; GND4 4.4,-2 | hole 1: -2.2,1; 2.2,1
SOD-123 = smd 1.4 x 1.4: A 1.85,0; C -1.85,0
SOD-323 = smd 1.35 x 0.8: A 1.27,0; C -1.27,0
TQFP100 = smd 1.5 x 0.35: 1 -8,6; 2 -8,5.5; 3 -8,5; 4 -8,4.5; 5 -8,4; 6 -8,3.5; 7 -8,3; 8 -8,2.5; 9 -8,2; 10 -8,1.5; 11 -8,1; 12 -8,0.5; 13 -8,0; 14 -8,-0.5; 15 -8,-1; 16 -8,-1.5; 17 -8,-2; 18 -8,-2.5; 19 -8,-3; 20 -8,-3.5; 21 -8,-4; 22 -8,-4.5; 23 -8,-5; 24 -8,-5.5; 25 -8,-6; 51 8,-6; 52 8,-5.5; 53 8,-5; 54 8,-4.5; 55 8,-4; 56 8,-3.5; 57 8,-3; 58 8,-2.5; 59 8,-2; 60 8,-1.5; 61 8,-1; 62 8,-0.5; 63 8,0; 64 8,0.5; 65 8,1; 66 8,1.5; 67 8,2; 68 8,2.5; 69 8,3; 70 8,3.5; 71 8,4; 72 8,4.5; 73 8,5; 74 8,5.5; 75 8,6 | smd 0.35 x 1.5: 26 -6,-8; 27 -5.5,-8; 28 -5,-8; 29 -4.5,-8; 30 -4,-8; 31 -3.5,-8; 32 -3,-8; 33 -2.5,-8; 34 -2,-8; 35 -1.5,-8; 36 -1,-8; 37 -0.5,-8; 38 0,-8; 39 0.5,-8; 40 1,-8; 41 1.5,-8; 42 2,-8; 43 2.5,-8; 44 3,-8; 45 3.5,-8; 46 4,-8; 47 4.5,-8; 48 5,-8; 49 5.5,-8; 50 6,-8; 76 6,8; 77 5.5,8; 78 5,8; 79 4.5,8; 80 4,8; 81 3.5,8; 82 3,8; 83 2.5,8; 84 2,8; 85 1.5,8; 86 1,8; 87 0.5,8; 88 0,8; 89 -0.5,8; 90 -1,8; 91 -1.5,8; 92 -2,8; 93 -2.5,8; 94 -3,8; 95 -3.5,8; 96 -4,8; 97 -4.5,8; 98 -5,8; 99 -5.5,8; 100 -6,8
SO16 = smd 0.66 x 2.032: 1 -4.445,-3.073; 2 -3.175,-3.073; 3 -1.905,-3.073; 4 -0.635,-3.073; 5 0.635,-3.073; 6 1.905,-3.073; 7 3.175,-3.073; 8 4.445,-3.073; 9 4.445,3.073; 10 3.175,3.073; 11 1.905,3.073; 12 0.635,3.073; 13 -0.635,3.073; 14 -1.905,3.073; 15 -3.175,3.073; 16 -4.445,3.073
TO252 = smd 1 x 1.6: 1 -2.28,-4.8; 2 2.28,-4.8 | smd 5.4 x 6.2: 3 0,2.5
SOT23-5L = smd 0.55 x 1.2: 1 -0.95,-1.3; 2 0,-1.3; 3 0.95,-1.3; 4 0.95,1.3; 5 -0.95,1.3
2X3 = drill 1.016 pad 1.88: 1 0,0; 2 0,2.54; 3 2.54,0; 4 2.54,2.54; 5 5.08,0; 6 5.08,2.54
CHIPLED_0603 = smd 0.8 x 0.8: A 0,-0.75; C 0,0.75
CHIPLED_0805 = smd 1.2 x 1.2: A 0,-1.05; C 0,1.05
R0805 = smd 1.1 x 1.4: 1 -1,0; 2 1,0
DTSM-6 = smd 1.55 x 1.3: 1 -3.975,2.25; 2 3.975,2.25; 3 -3.975,-2.25; 4 3.975,-2.25
BUZZER-12MM = drill 0.9: + 3.25,0; - -3.25,0
SSOP28DB = smd 0.348 x 1.397: 1 -4.225,-3.656; 2 -3.575,-3.656; 3 -2.925,-3.656; 4 -2.275,-3.656; 5 -1.625,-3.656; 6 -0.975,-3.656; 7 -0.325,-3.656; 8 0.325,-3.656; 9 0.975,-3.656; 10 1.625,-3.656; 11 2.275,-3.656; 12 2.925,-3.656; 13 3.575,-3.656; 14 4.225,-3.656; 15 4.225,3.656; 16 3.575,3.656; 17 2.925,3.656; 18 2.275,3.656; 19 1.625,3.656; 20 0.975,3.656; 21 0.325,3.656; 22 -0.325,3.656; 23 -0.975,3.656; 24 -1.625,3.656; 25 -2.275,3.656; 26 -2.925,3.656; 27 -3.575,3.656; 28 -4.225,3.656
LFCSP16_LQ = smd 0.8 x 0.25: 1 -1.5,0.75; 2 -1.5,0.25; 3 -1.5,-0.25; 4 -1.5,-0.75; 9 1.5,-0.75; 10 1.5,-0.25; 11 1.5,0.25; 12 1.5,0.75 | smd 0.25 x 0.8: 5 -0.75,-1.5; 6 -0.25,-1.5; 7 0.25,-1.5; 8 0.75,-1.5; 13 0.75,1.5; 14 0.25,1.5; 15 -0.25,1.5; 16 -0.75,1.5
SOT23-5 = smd 0.55 x 1.2: 1 -0.95,-1.3; 2 0,-1.3; 3 0.95,-1.3; 4 0.95,1.3; 5 -0.95,1.3
FGPMMOPA6H = smd 2 x 1: P$1 -8,6.75; P$2 -8,5.25; P$3 -8,3.75; P$4 -8,2.25; P$5 -8,0.75; P$6 -8,-0.75; P$7 -8,-2.25; P$8 -8,-3.75; P$9 -8,-5.25; P$10 -8,-6.75; P$11 8,-6.75; P$12 8,-5.25; P$13 8,-3.75; P$14 8,-2.25; P$15 8,-0.75; P$16 8,0.75; P$17 8,2.25; P$18 8,3.75; P$19 8,5.25; P$20 8,6.75 | hole 3: 0.2,0.8
PQFN50P200X200X80-10N = smd 0.35 x 0.38: 1 -0.765,0.25; 2 -0.765,-0.25; 3 -0.5,-0.765; 4 0,-0.765; 5 0.5,-0.765; 6 0.765,-0.25; 7 0.765,0.25; 8 0.5,0.765; 9 0,0.765; 10 -0.5,0.765
XBEE = drill 0.7 pad 1.422 square: 1 -11,5.5 | drill 0.7 pad 1.422: 2 -11,3.5; 3 -11,1.5; 4 -11,-0.5; 5 -11,-2.5; 6 -11,-4.5; 7 -11,-6.5; 8 -11,-8.5; 9 -11,-10.5; 10 -11,-12.5; 11 11,-12.5; 12 11,-10.5; 13 11,-8.5; 14 11,-6.5; 15 11,-4.5; 16 11,-2.5; 17 11,-0.5; 18 11,1.5; 19 11,3.5; 20 11,5.5
U.FL = smd 2.2 x 0.85: P$1 0,1.375; P$2 0,-1.375 | smd 1.05 x 1: P$3 1.525,0; P$4 -1.525,0
MICROSD = smd 0.7 x 1.5: 1 9,-10.64; 2 7.9,-10.24; 3 6.8,-10.64; 4 5.7,-11.04; 5 4.6,-10.64; 6 3.5,-11.04; 7 2.4,-10.64; 8 1.3,-10.64 | smd 1.8 x 1.4: CD1 2,-0.44; CD2 8,-0.44 | smd 1.4 x 1.9: MT1 0.4,-13.54; MT2 13.6,-14.44
HC49US = drill 0.7 pad 1.651: 1 -2.54,0; 2 2.54,0

### Placement (x,y rotation side)
100  30.8,14.1 270 top
ACT  60.2,67.56 0 bottom
B1  61.98,76.2 180 bottom
BATT_IN  31.75,79.25 0 top
BOTTOM_HEADER  33.02,6.1 0 top
C1  23.37,37.34 0 bottom
C2  33.53,56.39 270 top
C3  32,56.39 270 top
C4  18.54,23.37 90 top
C5  33.78,67.56 180 top
C6  33.78,74.42 180 top
C7  10.16,67.31 180 top
C8  50.04,73.15 90 top
C9  17.27,60.2 270 top
C10  53.59,81.79 180 top
C11  39.37,23.88 90 top
C12  41.15,23.88 90 top
C13  73.91,65.53 90 top
C14  7.62,25.91 270 top
C15  28.45,30.99 180 bottom
C16  28.45,28.7 180 bottom
C17  28.45,27.18 180 bottom
C18  24.13,34.04 90 bottom
C19  35.56,12.7 90 top
C20  26.42,71.63 0 bottom
C21  13.21,71.12 0 bottom
C22  32.26,67.31 180 bottom
C23  53.59,80.01 0 top
C24  25.65,60.45 270 top
C25  17.78,53.09 270 top
C26  11.43,64.52 270 top
C27  13.21,64.52 270 top
C28  21.84,65.53 90 top
C29  24.64,68.33 180 top
C30  14.48,59.69 90 top
C31  12.95,59.69 90 top
CN2  43.94,83.82 180 top
D1  34.29,74.93 90 bottom
D2  29.97,83.57 0 top
D3  33.02,53.59 0 bottom
D4  21.84,69.85 0 bottom
D5  64.77,33.53 270 top
FB1  26.42,73.15 180 bottom
IC1  44.45,44.45 0 top
IC2  63.25,61.21 0 bottom
IC3  26.42,76.71 0 top
IC4  35.05,84.84 90 bottom
IC5  59.94,30.48 180 top
ICSP  10.92,22.1 0 top
LED1  18.8,75.44 270 bottom
LED2  32.77,16 0 top
LED3  55.37,85.6 90 top
LED4  55.37,83.82 270 top
LED5  9.91,64.01 0 bottom
LEFT_HEADERS  6.1,55.37 270 top
R1  53.34,71.88 270 bottom
R2  26.42,69.85 180 bottom
R3  18.8,12.19 90 top
R4  22.1,75.44 180 bottom
R5  32.77,12.7 270 top
R6  46.74,2.79 270 top
R7  48.26,2.79 270 top
R8  52.07,85.6 180 top
R9  52.07,83.82 180 top
R10  13.21,69.6 0 bottom
R11  7.87,64.01 270 bottom
RIGHT_HEADERS  80.26,55.37 270 top
S1  24.89,11.94 0 top
SG1  27.24,21.91 0 top
TOP_HEADER  33.02,59.94 0 top
U1  43.69,71.88 0 top
U2  24.38,29.97 0 bottom
U3  26.92,34.04 180 bottom
U4  21.34,60.45 0 bottom
U5  22.35,72.64 270 bottom
U6  19.3,66.55 0 top
U7  28.19,66.55 0 top
U8  24.64,64.26 0 top
U9  15.75,64.26 0 top
U10  23.37,57.15 0 top
U11  19.56,56.39 270 top
U$15  65.79,29.97 0 top
U$55  7.37,59.18 180 bottom
X1  37.08,67.82 180 bottom
Y1  40.39,28.19 180 top

### Tracks (layer width: path | path; a pad name or v marks a point on that pad's centre or on a via)
3.3V
  Top 0.254: C8.2 49.99,74.17 47.35,74.17 46.74,74.78 46.74,75.39 U1.17
5.0V  (via drill 0.35)
  Top 0.203: 16,30.23 v21.59,35.81 | IC1.31 40.95,34.85 v40.13,34.04 | v36.07,34.04 29.97,34.04 v29.46,34.54
  Top 0.254: RIGHT_HEADERS.10 81.53,43.94 64.01,43.94 63.52,43.45 IC1.61 50.78,43.45 48.45,45.78 | v37.08,12.45 36.49,11.85 C19.1 BOTTOM_HEADER.4 36.83,7.37 36.83,5.33 40.22,1.94 R6.2 46.74,2.03 48.16,2.03 R7.2 | v20.32,12.7 19.98,13.04 R3.2 16.93,13.04 12.19,17.78 12.19,23.37 ICSP.2 8.65,26.91 C14.1 10.94,30.23 16,30.23 | LEFT_HEADERS.8 10.44,45.95 IC1.10 38.61,45.95 | C2.1 C3.1 | C2.1 33.02,57.75 TOP_HEADER.1 32.92,59.94 30.68,62.18 | IC1.31 40.95,44.14 | 40.95,44.14 39.12,45.97 39.09,45.95 38.61,45.95 | 48.45,45.78 IC1.80 | 38.61,45.95 38.45,46.11 IC1.100 38.41,52.63 37.49,52.63 33.53,57.1 C2.1 | 40.95,44.14 46.81,44.14 48.45,45.78 | C25.1 18.26,54.41 U11.3 18.09,55.47 17.88,55.47 17.27,56.08 17.27,56.69 18.09,57.51 U11.1 18.29,57.37 18.29,58.59 | 18.29,58.59 18.29,60.2 17.44,61.05 C9.1 16.7,61.62 U9.3 16.66,62.99 16.66,63.6 15.62,64.64 | U9.1 14.8,63.82 15.62,64.64 | 15.62,64.64 15.75,64.77 15.75,67.56 14.99,68.33 v13.97,68.33 | D2.C 29.21,83.57 v30.48,82.3 | IC3.2 28.7,73.67 28.63,73.74 | 28.63,73.74 v27.18,75.18 | LED3.A 57.15,84.57 57.15,83.06 56.9,82.8 55.47,82.8 | 55.47,82.8 55.12,82.8 54.62,83.3 LED4.A | 55.47,82.8 55.47,77.83 50.8,73.15 44.7,73.15 44.58,73.28 | 28.63,73.74 29.26,74.37 31.29,74.37 C6.+ | 25.6,61.98 25.6,62.79 U8.3 25.6,62.99 25.6,63.2 26.21,63.8 28.93,63.8 30.68,62.18 | 25.6,61.98 25.6,61.37 C24.1 | 24.18,61.98 23.77,62.38 23.77,62.79 U8.1 | 25.6,61.98 24.18,61.98 | 24.18,61.98 24.18,60.55 22.66,58.59 18.29,58.59 | 30.68,62.18 32.72,64.21 38.2,64.21 41.25,67.26 41.25,68.07 U1.4
  Top 0.406: U1.4 41.41,70.11 41.53,70.23 | 41.53,70.23 44.58,73.28 44.7,73.41 44.7,75.5 U1.20 | C6.+ 35.57,70.23 41.53,70.23
  Bottom 0.203: v21.59,35.81 22.69,35.81 C1.1 25.97,35.58 U3.1 25.97,34.73 26.42,34.29 27.69,34.29 27.87,34.48 U3.3 28.67,34.54 v29.46,34.54 | v40.13,34.04 v36.07,34.04
  Bottom 0.254: v37.08,12.45 20.57,12.45 v20.32,12.7 | v13.97,68.33 13.63,68.33 R10.2 | 23.62,75.44 v30.48,82.3 32.16,82.3 IC4.1 34.36,83.89 35.05,84.58 35.05,85.34 34.61,85.79 IC4.3 | 23.62,75.44 R4.2 | 23.62,75.44 23.65,75.41 U5.1 | v27.18,75.18 26.42,75.18 26.16,75.44 23.62,75.44
+3V3  (via drill 0.35)
  Top 0.254: C13.+ 73.76,66.85 v67.87,60.96 64.21,64.62 v54.25,64.62
  Bottom 0.254: 41.86,76.5 37.13,76.5 36.12,78.03 36.37,83.72 IC4.5 | 41.86,76.5 42.67,77.83 42.67,78.84 X1.4 | v67.87,60.96 67.87,58.32 IC2.1 | v54.25,64.62 41.86,76.5
ADC0  (via drill 0.35)
  Top 0.203: v42.42,48.77 40.64,48.77 39.37,50.04 39.37,51.05 39.95,51.63 IC1.97
  Top 0.254: IC1.97 39.95,54.03 36.83,57.66 36.83,61.21 TOP_HEADER.4
  Bottom 0.203: U2.5 25.13,27.95 25.65,27.18 C17.1 28.61,26.16 30.23,26.16 32.77,29.21 32.77,32 42.42,41.66 v42.42,48.77
ADC1  (via drill 0.35)
  Top 0.203: v41.66,49.53 40.64,49.53 39.88,50.29 39.88,50.8 40.45,51.37 IC1.96
  Top 0.254: IC1.96 40.45,54.55 38.1,56.9 TOP_HEADER.5
  Bottom 0.203: U2.4 27.59,29.22 | 27.59,29.22 C16.1 | 27.59,29.22 28.08,29.72 30.73,29.72 32,31.24 32,32.26 41.66,41.91 v41.66,49.53
ADC2  (via drill 0.35)
  Top 0.203: v40.89,50.55 40.89,52.39 IC1.95
  Top 0.254: IC1.95 40.95,55.06 39.37,56.64 39.37,61.21 TOP_HEADER.6
  Bottom 0.203: U2.16 27.11,31.47 C15.1 28.36,31.75 30.48,31.75 40.89,42.16 v40.89,50.55
ADC3
  Top 0.254: IC1.94 41.45,55.83 40.64,56.64 TOP_HEADER.7
ADC4
  Top 0.254: IC1.93 41.95,61.17 TOP_HEADER.8
ADC5
  Top 0.254: IC1.92 42.45,55.91 43.18,56.64 TOP_HEADER.9
ADC6
  Top 0.254: IC1.91 42.95,55.65 44.45,57.15 44.45,61.21 TOP_HEADER.10
ADC7
  Top 0.254: IC1.90 43.45,55.39 45.72,57.66 TOP_HEADER.11
ADC8
  Top 0.254: IC1.89 43.95,55.13 46.99,58.17 46.99,61.21 TOP_HEADER.12
ADC9
  Top 0.254: IC1.88 44.45,54.86 48.26,58.67 TOP_HEADER.13
ADC10
  Top 0.254: IC1.87 44.95,54.6 49.53,59.18 49.53,61.21 TOP_HEADER.14
ADC11
  Top 0.254: IC1.86 45.45,54.34 50.8,59.44 TOP_HEADER.15
ADC12
  Top 0.254: IC1.85 45.95,54.08 50.29,58.17 51.05,58.17 52.07,59.18 52.07,61.21 TOP_HEADER.16
ADC13
  Top 0.254: IC1.84 46.45,53.82 50.55,57.66 52.32,57.66 53.34,58.67 TOP_HEADER.17
ADC14
  Top 0.254: IC1.83 46.95,53.55 50.8,57.15 52.58,57.15 54.61,59.18 54.61,61.21 TOP_HEADER.18
ADC15
  Top 0.254: IC1.82 47.45,53.29 51.05,56.64 53.85,56.64 55.88,58.67 TOP_HEADER.19
AREF
  Top 0.254: IC1.98 39.45,53.77 35.56,57.91 TOP_HEADER.3
BATT_IN  (via drill 0.35)
  Top 0.254: v63.6,32.92 64.62,31.9 D5.A
  Top 0.61: D5.A 64.77,10.41 57.91,3.56 55.88,3.56 BOTTOM_HEADER.17
  Bottom 0.254: BATT_IN.2 34.34,79.25 34.34,76.81 D1.A 34.34,76.61 35.76,76.61 43.89,68.48 43.89,66.04 46.94,62.99 46.94,58.93 63.6,42.27 v63.6,32.92
D0_RX0  (via drill 0.35)
  Top 0.254: IC1.2 14.22,49.95 | 14.22,49.95 14.06,49.95 9.91,54.1 7.37,54.1 LEFT_HEADERS.1 | v37.19,69.49 37.59,69.49 38.81,68.28 39.42,68.28 U1.1 | v25.6,54.05 v31.01,59.33 | 14.22,49.95 v14.22,50.19
  Bottom 0.254: v37.19,69.49 37.19,69.09 31.01,63.3 v31.01,59.33 | v25.6,54.05 18.09,54.05 v14.22,50.19
D1_TX0  (via drill 0.2, 0.35)
  Top 0.254: IC1.3 v34.04,49.39 13.54,49.45 10.16,52.83 LEFT_HEADERS.4 | v39.22,64.21 42.06,67.06 42.06,68.07 U1.5 | v33.53,51.21 v35.76,53.44
  Bottom 0.254: v39.22,64.21 38,64.21 36.78,62.99 36.78,54.46 v35.76,53.44 | v34.04,49.39 33.53,49.96 v33.53,51.21
D2  (via drill 0.35)
  Top 0.254: LEFT_HEADERS.6 10.16,50.29 12.5,47.95 IC1.6 37.79,47.95 37.85,48.01 37.85,50.8 v37.34,51.31
  Bottom 0.254: D3.C 36.58,51.31 v37.34,51.31
D3
  Top 0.254: IC1.7 11.48,47.45 9.91,49.02 7.37,49.02 LEFT_HEADERS.5
  Bottom 0.254: U4.P$9 29.26,55.07 27.64,55.07 21.54,48.97 7.32,48.97 6.1,50.19 LEFT_HEADERS.5
D4
  Top 0.254: IC1.1 15.08,50.45 10.16,55.37 LEFT_HEADERS.2
D5
  Top 0.254: IC1.5 13.27,48.45 10.16,51.56 7.37,51.56 LEFT_HEADERS.3
D6
  Top 0.254: IC1.15 18.56,43.45 17.78,42.67 LEFT_HEADERS.12 7.92,42.67 6.71,43.89 5.69,43.89 4.88,44.7 4.88,55.88 10.16,61.16 10.16,68.48 17.07,75.39 25.81,75.39 26.21,74.98 26.21,74.37 25.81,73.97 23.77,73.97 20.12,70.31 20.12,68.68 20.73,68.07 20.73,66.65 20.32,66.24 20.12,66.24 U6.6
D7  (via drill 0.35)
  Top 0.254: IC1.16 19.07,42.95 17.53,41.4 7.37,41.4 LEFT_HEADERS.11 | v29.46,68.68 29.46,66.45 29.26,66.24 29.06,66.24 U7.6 | v35.15,71.79 35.15,72.75 34.14,73.76 v34.14,74.98
  Bottom 0.254: v29.46,68.68 32.11,68.68 v35.15,71.79 | v34.14,74.98 36.78,74.98 41.86,69.9 41.86,51.21 43.48,49.58 43.48,36.37 32.72,25.6 24.99,25.6 9.14,41.45 7.32,41.45 LEFT_HEADERS.11
D8  (via drill 0.35)
  Top 0.254: LEFT_HEADERS.14 17.27,40.13 19.59,42.45 IC1.17 36.58,42.47 37.39,42.47 39.62,40.23 v39.62,37.8 | v24.59,59.94 24.79,59.74 24.79,57.3 24.38,56.9 24.18,56.9 U10.6
  Bottom 0.254: v24.59,59.94 24.59,61.57 22.15,64.01 19.71,64.01 19.1,64.62 19.1,66.04 22.15,69.09 22.15,70.51 22.35,70.71 26.21,70.71 26.42,70.92 26.42,73.76 26.82,74.17 36.98,74.17 40.44,70.71 40.44,64.01 39.42,62.99 39.42,53.03 43.08,49.38 43.08,41.25 v39.62,37.8
D9
  Top 0.254: IC1.18 20.11,41.95 17.02,38.86 7.37,38.86 LEFT_HEADERS.13
D10
  Top 0.254: IC1.23 23.19,39.45 16.26,32.51 LEFT_HEADERS.20
D11
  Top 0.254: IC1.24 23.46,38.95 15.75,31.24 7.11,31.24 6.1,32.26 LEFT_HEADERS.19
D13
  Top 0.254: IC1.26 38.45,35.15 34.04,30.73 34.04,12.7 33.19,11.85 R5.2 33.02,11.6 BOTTOM_HEADER.2
D14_TX3
  Top 0.254: IC1.64 62.73,44.95 65.28,47.5 80.01,47.5 RIGHT_HEADERS.7
D15_RX3
  Top 0.254: IC1.63 62.99,44.45 65.02,46.48 81.53,46.48 RIGHT_HEADERS.8
D16_TX2
  Top 0.254: IC1.13 17.27,44.45 16.76,43.94 7.37,43.94 LEFT_HEADERS.9
D17_RX2
  Top 0.254: IC1.12 8.9,44.95 LEFT_HEADERS.10
D18_TX1
  Top 0.254: IC1.46 48.45,34.86 51.93,31.62 | 51.93,31.62 52.07,31.5 | BOTTOM_HEADER.15 52.07,7.11 52.07,31.49 51.93,31.62
  Bottom 0.254: U$15.3 52.07,28.5 52.07,7.11 51.05,6.1 BOTTOM_HEADER.15
D19_RX1
  Top 0.254: IC1.45 47.95,34.6 51.31,31.24 51.31,9.14 BOTTOM_HEADER.16
  Bottom 0.254: U$15.2 50.8,29.23 BOTTOM_HEADER.16
D20_SDA
  Top 0.254: IC1.44 47.45,34.34 50.8,30.99 50.8,10.67 49.53,9.4 49.53,7.37 BOTTOM_HEADER.13 R7.1
D21_SCL  (via drill 0.35)
  Top 0.254: IC1.43 46.95,34.08 50.29,30.73 50.29,11.18 BOTTOM_HEADER.14 | v46.99,5.08 46.99,3.9 R6.1
  Bottom 0.254: BOTTOM_HEADER.14 46.99,7.37 v46.99,5.08
D22
  Top 0.254: IC1.78 49.45,53.77 51.56,55.88 54.1,55.88 57.4,59.18 57.4,60.96 TOP_HEADER.20
D25
  Top 0.254: IC1.75 71.79,50.45 76.71,55.37 RIGHT_HEADERS.1
D26
  Top 0.254: IC1.74 73.06,49.95 77.22,54.1 81.53,54.1 RIGHT_HEADERS.2
D27
  Top 0.254: IC1.73 75.1,49.45 78.49,52.83 RIGHT_HEADERS.3
D28
  Top 0.254: IC1.72 76.38,48.95 78.99,51.56 81.53,51.56 RIGHT_HEADERS.4
D29
  Top 0.254: IC1.71 77.15,48.45 78.99,50.29 RIGHT_HEADERS.5
D30
  Top 0.254: IC1.60 79.99,42.95 RIGHT_HEADERS.11
D31
  Top 0.254: IC1.59 78.45,42.45 79.5,41.4 81.53,41.4 RIGHT_HEADERS.12
D32
  Top 0.254: IC1.58 76.67,41.95 78.49,40.13 RIGHT_HEADERS.13
D33
  Top 0.254: IC1.57 76.15,41.45 78.74,38.86 81.53,38.86 RIGHT_HEADERS.14
D34
  Top 0.254: IC1.56 75.38,40.95 78.74,37.59 RIGHT_HEADERS.15
D35
  Top 0.254: IC1.55 74.87,40.45 78.99,36.32 81.53,36.32 RIGHT_HEADERS.16
D36
  Top 0.254: IC1.54 74.6,39.95 79.5,35.05 RIGHT_HEADERS.17
D37
  Top 0.254: IC1.53 70.79,39.45 75.69,34.54 78.49,34.54 79.25,33.78 81.53,33.78 RIGHT_HEADERS.18
D38
  Top 0.254: IC1.50 50.45,34.89 53.34,32 BOTTOM_HEADER.18
D39
  Top 0.254: IC1.70 78.18,47.95 79.25,49.02 81.53,49.02 RIGHT_HEADERS.6
D40
  Top 0.254: IC1.52 69.76,38.95 76.2,32.51 RIGHT_HEADERS.19
D41
  Top 0.254: IC1.51 68.23,38.45 76.2,30.48 80.77,30.48 RIGHT_HEADERS.20
D42
  Top 0.254: IC1.42 46.45,33.81 49.78,30.48 49.78,12.7 46.99,9.91 46.99,7.37 BOTTOM_HEADER.11
D43
  Top 0.254: IC1.41 45.95,33.55 49.28,30.23 49.28,13.21 45.72,9.65 BOTTOM_HEADER.12
D44
  Top 0.254: IC1.40 45.45,33.29 48.77,29.97 48.77,13.72 44.45,9.4 44.45,7.37 BOTTOM_HEADER.9
D45
  Top 0.254: IC1.39 44.95,33.03 48.26,29.72 48.26,14.99 43.18,9.91 BOTTOM_HEADER.10
  Bottom 0.305: BOTTOM_HEADER.10 43.18,12.76 34.04,21.91 SG1.+
D46
  Top 0.254: IC1.38 44.45,32.77 47.75,29.46 47.75,15.49 41.91,9.65 41.91,7.37 BOTTOM_HEADER.7
D47
  Top 0.254: IC1.37 43.95,32.5 47.24,29.21 47.24,16.26 40.64,9.65 BOTTOM_HEADER.8
D48
  Top 0.254: IC1.36 43.45,32.24 46.74,28.96 46.74,16.76 39.37,9.4 39.37,7.37 BOTTOM_HEADER.5
D49
  Top 0.254: IC1.35 42.95,31.98 46.23,28.7 46.23,17.27 38.1,9.14 BOTTOM_HEADER.6
D50_MISO  (via drill 0.35)
  Top 0.254: IC1.22 22.68,39.95 v22.35,39.62 16.51,33.78 7.11,33.78 6.1,34.8 LEFT_HEADERS.17 | v26.42,62.99 27.64,61.9 27.64,58.93 24.99,56.29 23.98,56.29 U10.5 | v25.2,64.21 27.43,64.21 28.85,65.63 | v20.73,65.63 19.91,65.63 U6.5 | v37.39,78.03 37.39,76 38,75.39 v38,72.14 | v34.14,68.78 34.14,67.67 32.11,65.63 28.85,65.63 | 28.85,65.63 U7.5
  Bottom 0.254: ICSP.1 10.67,22.1 4.83,27.94 4.83,33.78 LEFT_HEADERS.17 | v26.42,62.99 v25.2,64.21 23.77,65.63 v20.73,65.63 | v37.39,78.03 37.39,77.83 37.8,77.42 39.01,77.42 39.42,77.83 39.42,78.44 X1.7 | v34.14,68.78 36.52,71.17 | 36.52,71.17 v38,72.14 | 36.52,71.17 38,69.7 37.49,67.77 34.34,64.62 34.34,55.27 33.33,54.25 33.33,52.43 39.83,45.92 39.83,44.7 34.75,39.62 v22.35,39.62
D51_MOSI  (via drill 0.2, 0.35)
  Top 0.152: v28,66.48 U7.4
  Top 0.254: IC1.21 22.16,40.45 v21.34,39.62 16.51,34.8 8.89,34.8 LEFT_HEADERS.18 | U10.4 v23.37,55.22 23.37,55.02 v27.43,51.71 | U6.4 19.3,65.43 v19.91,64.82 | v26.82,59.13 v26.82,61.67 | v61.57,56.24 58.93,56.24 v53.65,51.21
  Bottom 0.152: v26.82,59.13 28.14,60.45 30.48,60.45 30.61,60.58 30.61,64.77 30.48,64.9 28.07,64.9 27.69,65.28 27.69,65.91 v28,66.48
  Bottom 0.254: ICSP.4 13.46,26.01 | 13.46,26.01 13.46,30.23 LEFT_HEADERS.18 | v27.43,51.71 30.48,51.71 35.76,45.92 39.01,45.92 39.42,45.52 39.42,44.91 34.95,40.44 22.15,40.44 v21.34,39.62 | v19.91,64.82 23.55,64.82 v26.82,61.67 | v26.82,59.13 23.37,55.68 v23.37,55.22 | v61.57,56.24 62.59,57.51 62.59,58.12 IC2.5 | v53.65,51.21 53.65,45.92 32.92,25.2 17.27,25.2 16.46,26.01 13.46,26.01 | 13.41,26.01 13.46,26.01
D52_SCK  (via drill 0.35)
  Top 0.152: U7.2 26.41,66.3 v25.84,66.8 | v24.51,67.18 24,66.42 23.11,66.42 23.11,66.04 22.73,65.66 21.46,65.66 20.19,64.14 17.68,64.14
  Top 0.254: IC1.20 21.65,40.95 17.02,36.32 7.37,36.32 LEFT_HEADERS.15 | v17.68,62.18 17.68,64.14 17.68,65.43 18.49,66.24 U6.2 | v15.65,54.05 v15.65,60.15 | v21.95,56.29 22.55,56.9 U10.2
  Bottom 0.152: v25.84,66.8 25.15,66.8 v24.51,67.18
  Bottom 0.254: IC2.9 58.93,64.21 58.93,63.6 59.54,62.99 62.23,61.21 65.02,58.93 65.02,58.32 IC2.3 65.02,58.12 65.02,33.33 63.8,32.11 60.35,32.11 55.88,36.58 47.95,36.58 34.75,23.37 14.83,23.37 13.61,22.15 ICSP.3 12.19,23.37 12.19,26.67 7.37,31.5 7.37,36.32 LEFT_HEADERS.15 3.05,40.64 3.05,48.97 5.69,51.61 13.21,51.61 v15.65,54.05 17.88,56.29 v21.95,56.29 | v15.65,60.15 v17.68,62.18
D53_SS  (via drill 0.35)
  Top 0.254: LEFT_HEADERS.16 17.02,37.59 20.88,41.45 IC1.19 36.58,41.45 37.39,41.45 v37.8,41.05 | v59.94,60.15 56.29,63.8 39.83,63.8 39.42,63.4 39.01,63.4 38.61,63.8 35.15,63.8 34.34,62.99 34.34,57.05 v37.8,53.59
  Bottom 0.254: v59.94,60.15 59.94,58.32 IC2.7 | v37.8,53.59 37.8,51.82 40.23,49.38 40.23,43.48 v37.8,41.05
FIX  (via drill 0.2)
  Top 0.254: v16.51,56.13 16.51,53.59 v15.75,52.83 | v13.72,51.05 v12.19,52.58
  Bottom 0.254: U4.P$5 27.95,61.2 27.94,61.21 24.13,57.4 18.29,57.4 v16.51,56.13 | LED5.A 9.91,62.74 11.18,61.47 11.18,53.59 v12.19,52.58 | v15.75,52.83 13.97,51.05 v13.72,51.05
GND  (via drill 0.2, 0.3, 0.35)
  Top 0.152: U10.3 22.99,56.76 23.11,57.15 23.37,57.4 U10.9 | U6.3 19.18,66.35 U6.9 | v26.42,65.79 26.67,65.78 U7.3 | v48.77,72.39 45.21,72.39 v44.96,72.14 | v43.43,73.66 44.01,74.24 U1.21 | v22.67,74.11 20.19,71.88 20.19,70.99 19.81,70.61 19.81,67.32 U6.8 | 27.31,68.2 v27.18,68.2 27.81,68.2 28.19,67.82 U7.9
  Top 0.203: v31.24,28.96 30.73,29.46 v30.73,30.99 | C8.1 48.86,72.3 v48.77,72.39 | C5.- 36.18,68.47 v35.31,68.83 34.29,69.85 v34.04,69.85 | v36.32,72.64 36.32,74.28 C6.- | v33.78,65.02 31.5,64.77 v31.24,64.52
  Top 0.254: IC1.62 63.25,43.95 64.52,45.21 RIGHT_HEADERS.9 | IC1.99 38.95,53.51 v35.05,57.4 | v35.12,54.42 33.87,55.54 C2.2 | C3.2 30.73,56.81 v30.73,57.4 | C10.1 54.44,82.21 53.85,82.8 v52.32,82.8 | v37.34,82.8 37.08,83.06 v35.05,83.06 | v36.07,84.84 v32.51,84.84 | C19.2 35.56,17.27 v35.81,17.53 | v33.27,18.8 32.77,18.29 LED2.C | U9.2 15.75,61.21 15.07,60.54 C30.2 | C25.2 17.87,52.32 v18.8,52.32 | v21.59,53.09 22.35,53.85 22.35,55.37 22.87,55.89 U10.3 | v59.69,61.47 61.21,62.99 v61.47,62.48 | U11.2 19.05,56.39 19.56,56.9 v19.56,57.98 | v17.27,58.17 C9.2 | C31.2 12.79,60.71 v11.75,60.71 | v11.94,62.48 11.94,63.16 C26.2 | U10.8 23.87,58.67 v23.88,58.67
  Bottom 0.152: 28.25,64.2 v26.42,65.79 26.42,67.82 26.92,68.07 27.05,68.07 v27.18,68.2 | v44.96,72.14 v43.43,73.66 | U5.2 22.73,72.64 22.61,72.77 22.61,74.42 v22.67,74.11
  Bottom 0.203: C16.2 30.99,28.7 v31.24,28.96 | v30.73,30.99 C15.2 | v48.77,72.39 v46.48,74.17 | C22.2 34.04,67.06 v35.31,68.83 | v34.04,69.85 36.32,72.14 v36.32,72.64 | TOP_HEADER.2 33.78,63.25 v33.78,65.02 | v31.24,64.52 30.93,64.2
  Bottom 0.254: v35.05,57.4 v35.12,54.42 | v30.73,57.4 30.04,57.4 U4.P$8 | v52.32,82.8 51.23,82.8 X1.MT2 | X1.MT1 37.48,82.66 v37.34,82.8 | v35.05,83.06 35.05,83.82 v36.07,84.84 | v32.51,84.84 IC4.2 | v35.81,17.53 34.54,18.8 v33.27,18.8 | v18.8,52.32 20.83,52.32 v21.59,53.09 | IC2.8 58.8,60.58 v59.69,61.47 | v61.47,62.48 61.47,64.16 IC2.11 | v19.56,57.98 v17.27,58.17 | v11.75,60.71 11.68,62.23 v11.94,62.48 | v23.88,58.67 24.64,58.67 v25.65,59.69 25.65,61.21 24.64,62.23 U8.2
  other vias: 24.64,62.96 29.34,64.2
  pour Top: 44.45,0 arc90 88.9,44.45 arc90 44.45,88.9 arc90 0,44.45 arc90
  pour Bottom: 44.45,0 arc90 88.9,44.45 arc90 44.45,88.9 arc90 0,44.45 arc90
N$3
  Bottom 0.254: ACT.A 60.15,66.45 60.15,64.41 IC2.10
N$15
  Top 0.61: IC5.1 62.32,35.38 D5.C
N$16  (via drill 0.35)
  Top 0.254: v47.95,76.81 47.95,75.59 U1.15 | v46.33,76.81 45.72,76.81 44.09,78.44 44.09,79.65 CN2.D+
  Bottom 0.254: v46.33,76.81 v47.95,76.81
N$17
  Top 0.254: U1.16 47.14,75.59 47.14,77.01 45.92,78.23 45.11,78.23 44.91,78.44 44.91,79.65 CN2.D-
N$19
  Bottom 0.254: R4.1 LED1.A
N$20
  Top 0.254: R5.1 LED2.A
N$21
  Top 0.254: R8.1 LED3.C
N$22  (via drill 0.35)
  Top 0.254: v49.99,80.06 51.21,81.28 51.21,83.72 R9.2 | v41.45,80.06 41.45,78.23 43.28,76.4 43.28,75.59 U1.22
  Bottom 0.254: v49.99,80.06 46.74,80.06 46.33,80.47 41.86,80.47 v41.45,80.06
N$23
  Top 0.254: R8.2 51.21,85.55 50.8,85.55 49.58,84.33 46.94,84.33 46.13,85.14 41.66,85.14 38.2,81.69 38.2,79.05 40.64,76.61 42.27,76.61 42.67,76.2 42.67,75.59 U1.23
N$24
  Top 0.254: R9.1 53.94,84.84 55.88,84.84 56.12,84.59 LED4.C
N$27
  Bottom 0.254: 52.3,73.91 46.13,80.06 42.47,80.06 41.86,79.45 41.86,78.64 X1.5 | 61.98,68.48 61.98,62.99 65.43,59.54 65.63,59.54 66.24,58.93 66.24,58.32 IC2.2
  Bottom 0.305: 52.3,73.91 54.55,73.91 55.17,73.3 55.17,70.35 55.92,69.6 60.86,69.6 61.98,68.48
N$31  (via drill 0.35)
  Top 0.254: v15.04,61.77 11.79,61.77 10.57,62.99 10.57,66.04 10.97,66.45 10.97,67.26 C7.1 | v20.93,68.89 20.93,70.51 23.57,73.15 25.6,73.15 28.04,70.71 34.09,70.71 36.63,68.68 37.8,68.68 38.81,67.67 38.81,67.46 39.22,67.06 39.62,67.06 40.03,67.46 40.03,68.07 U1.2
  Bottom 0.254: v15.04,61.77 15.04,62.99 v20.93,68.89
N$32
  Bottom 0.254: 52.22,72.95 49.17,72.95 45.11,77.01 45.11,78.03 X1.2 | 52.22,72.95 53.24,72.95 R1.1 | IC2.6 61.16,58.32 61.21,58.37 61.21,61.21 59.94,62.23 58.93,62.23 52.22,68.94 52.22,72.95
N$33
  Bottom 0.254: ACT.C 60.15,68.68 55.47,68.68 53.44,70.71 R1.2
N$34
  Bottom 0.254: X1.3 43.89,78.44 43.89,75.44 58.12,61.98 58.12,56.39 59.08,55.17 62.23,55.17 63.8,57.51 63.8,58.12 IC2.4
N$35  (via drill 0.2)
  Top 0.254: v11.75,56.07 10.16,57.4 v10.16,58.17
  Bottom 0.254: 12.59,53.7 U4.P$11 12.34,53.7 11.68,54.36 v11.75,56.07 | 9.4,59.18 U$55.P$3 9.14,59.18 v10.16,58.17
N$36
  Bottom 0.203: C18.1 U2.14 U2.15 24.63,32 25.37,32.74 U3.5
N$37
  Bottom 0.254: R10.1 C21.1 14.06,72.56 14.22,72.9 15.75,74.42 21.84,74.42 22.1,74.17 22.1,72.39 22.79,71.69 U5.3
N$38  (via drill 0.35)
  Top 0.254: v24.38,69.7 23.57,69.7 22.76,68.89 22.76,67.67 v23.19,67.11 | v27.64,62.79 28.45,62.79 31.7,59.54 v31.7,58.52
  Bottom 0.254: U4.P$10 29.44,53.59 D3.A 31.7,53.65 v31.7,58.52 | v24.38,69.7 25.4,69.7 R2.1 | v27.64,62.79 24.64,65.79 24.26,65.79 23.19,66.85 v23.19,67.11
N$39  (via drill 0.35)
  Top 0.254: v19.24,68.48 16.05,68.48 15.04,69.49 13.01,69.49 v11.99,68.48 | v37.74,85.45 v31.85,85.45
  Bottom 0.254: v19.24,68.48 20.52,69.7 D4.A | v11.99,68.48 11.38,69.09 11.38,71.73 18.9,79.25 26.42,79.25 v31.85,85.45 | v37.74,85.45 40.28,80.87 50.19,80.87 54.05,77.01 B1.+$1 55.72,74.23 55.72,70.5 56.08,70.13 56.08,70.1 67.88,70.1 68.7,70.93 68.7,72.27 70.23,73.79 70.23,76.17 B1.+$2
N$40
  Bottom 0.254: FB1.2 C20.1 R2.2 29.34,67.78 29.34,67.31 | U4.P$1 29.34,67.31 | C22.1 29.34,67.31
N$42
  Top 0.305: 100.1 23.99,21.75 SG1.-
N$43
  Bottom 0.254: R11.1 8.07,65.06 LED5.C
OUT  (via drill 0.35)
  Top 0.254: v25.4,74.68 20.83,74.68 v19.81,73.66
  Bottom 0.254: FB1.1 25.57,74.51 v25.4,74.68 | v19.81,73.66 19.88,73.59 U5.5
OUT1
  Top 0.254: C26.1 C27.1 | C27.1 14.6,65.37 U9.5 | U6.1 18.69,66.85 18.69,67.26 U6.10 18.69,67.46 16.46,67.46 14.83,69.09 13.61,69.09 13.21,68.68 C27.1
OUT2
  Top 0.254: 27.43,67.06 27.43,66.85 U7.1 | 27.43,67.06 27.64,67.26 U7.10 | 27.43,67.06 26.82,67.06 26.01,67.87 | 26.01,67.87 25.6,68.28 C29.1 26.01,67.87 | C28.1 21.95,64.82 22.96,64.82 23.57,65.43 U8.5 23.84,65.57 26.01,67.87
OUT3
  Top 0.254: C31.1 C30.1 14.48,52.58 16,51.05 18.54,51.05 19.56,52.07 19.81,55.88 19.91,56.39 U11.5 20.93,57.51 22.55,57.51 U10.1 22.76,57.51 22.76,57.91 U10.10
RESET  (via drill 0.35)
  Top 0.254: S1.3 S1.4 29.43,9.69 BOTTOM_HEADER.1 34.29,7.37 34.29,10.41 34.54,10.67 34.54,29.46 40.45,35.37 IC1.30 arc-90 40.39,36.51 40.39,43.94 39.12,45.21 v38.61,45.21 | S1.3 19.69,9.69 R3.1 | ICSP.5 18.12,22.1 18.33,22.31 | 18.33,22.31 C4.1 | S1.3 22.35,11.12 22.35,18.29 18.33,22.31 | v3.81,44.96 3.81,58.42 5.08,59.69 5.08,61.47 9.31,65.7 C7.2
  Bottom 0.254: v38.61,45.21 12.7,45.21 11.43,43.94 4.83,43.94 v3.81,44.96
VBACKUP
  Bottom 0.254: 28.7,62.79 29.26,62.79 U4.P$4 | 28.7,62.79 28.65,62.79 | D4.C 23.16,69.7 23.16,68.02 23.5,67.69 23.88,67.69 23.88,66.86 24.64,66.17 25.02,66.17 27.69,63.5 27.99,63.5 28.7,62.79
VCC
  Top 0.61: IC5.2 57.47,35.47 U$15.1
VIN  (via drill 0.35)
  Top 0.254: v30.68,69.49 30.48,69.49 30.28,69.29
  Top 0.813: IC3.1 26.19,69.85 29.72,69.85 30.28,69.29 31.38,68.19 C5.+
  Bottom 0.254: v30.68,69.49 34.14,72.95 D1.C
VUSB  (via drill 0.35)
  Top 0.254: C10.2 C23.1 51.47,78.74 46.56,78.74 CN2.VBUS 45.52,79.86 45.52,80.87 43.89,82.5 v43.89,84.33 | v39.47,83.97 31.9,83.72 D2.A
  Bottom 0.254: v39.47,83.97 40.23,83.72 41.05,84.53 43.69,84.53 v43.89,84.33
XTAL1
  Top 0.254: C12.2 41.15,26.42 Y1.1 42.45,28.67 IC1.34
XTAL2
  Top 0.254: C11.2 39.37,26.67 Y1.2 41.95,32.3 IC1.33

### Text on the board
tPlace: Flight Computer Rev. A | Longhorn Rocketry Association
tOrigins: Main Board